# Altium project PCB_XEM-S91.PRJPCB (part 1 of 2)
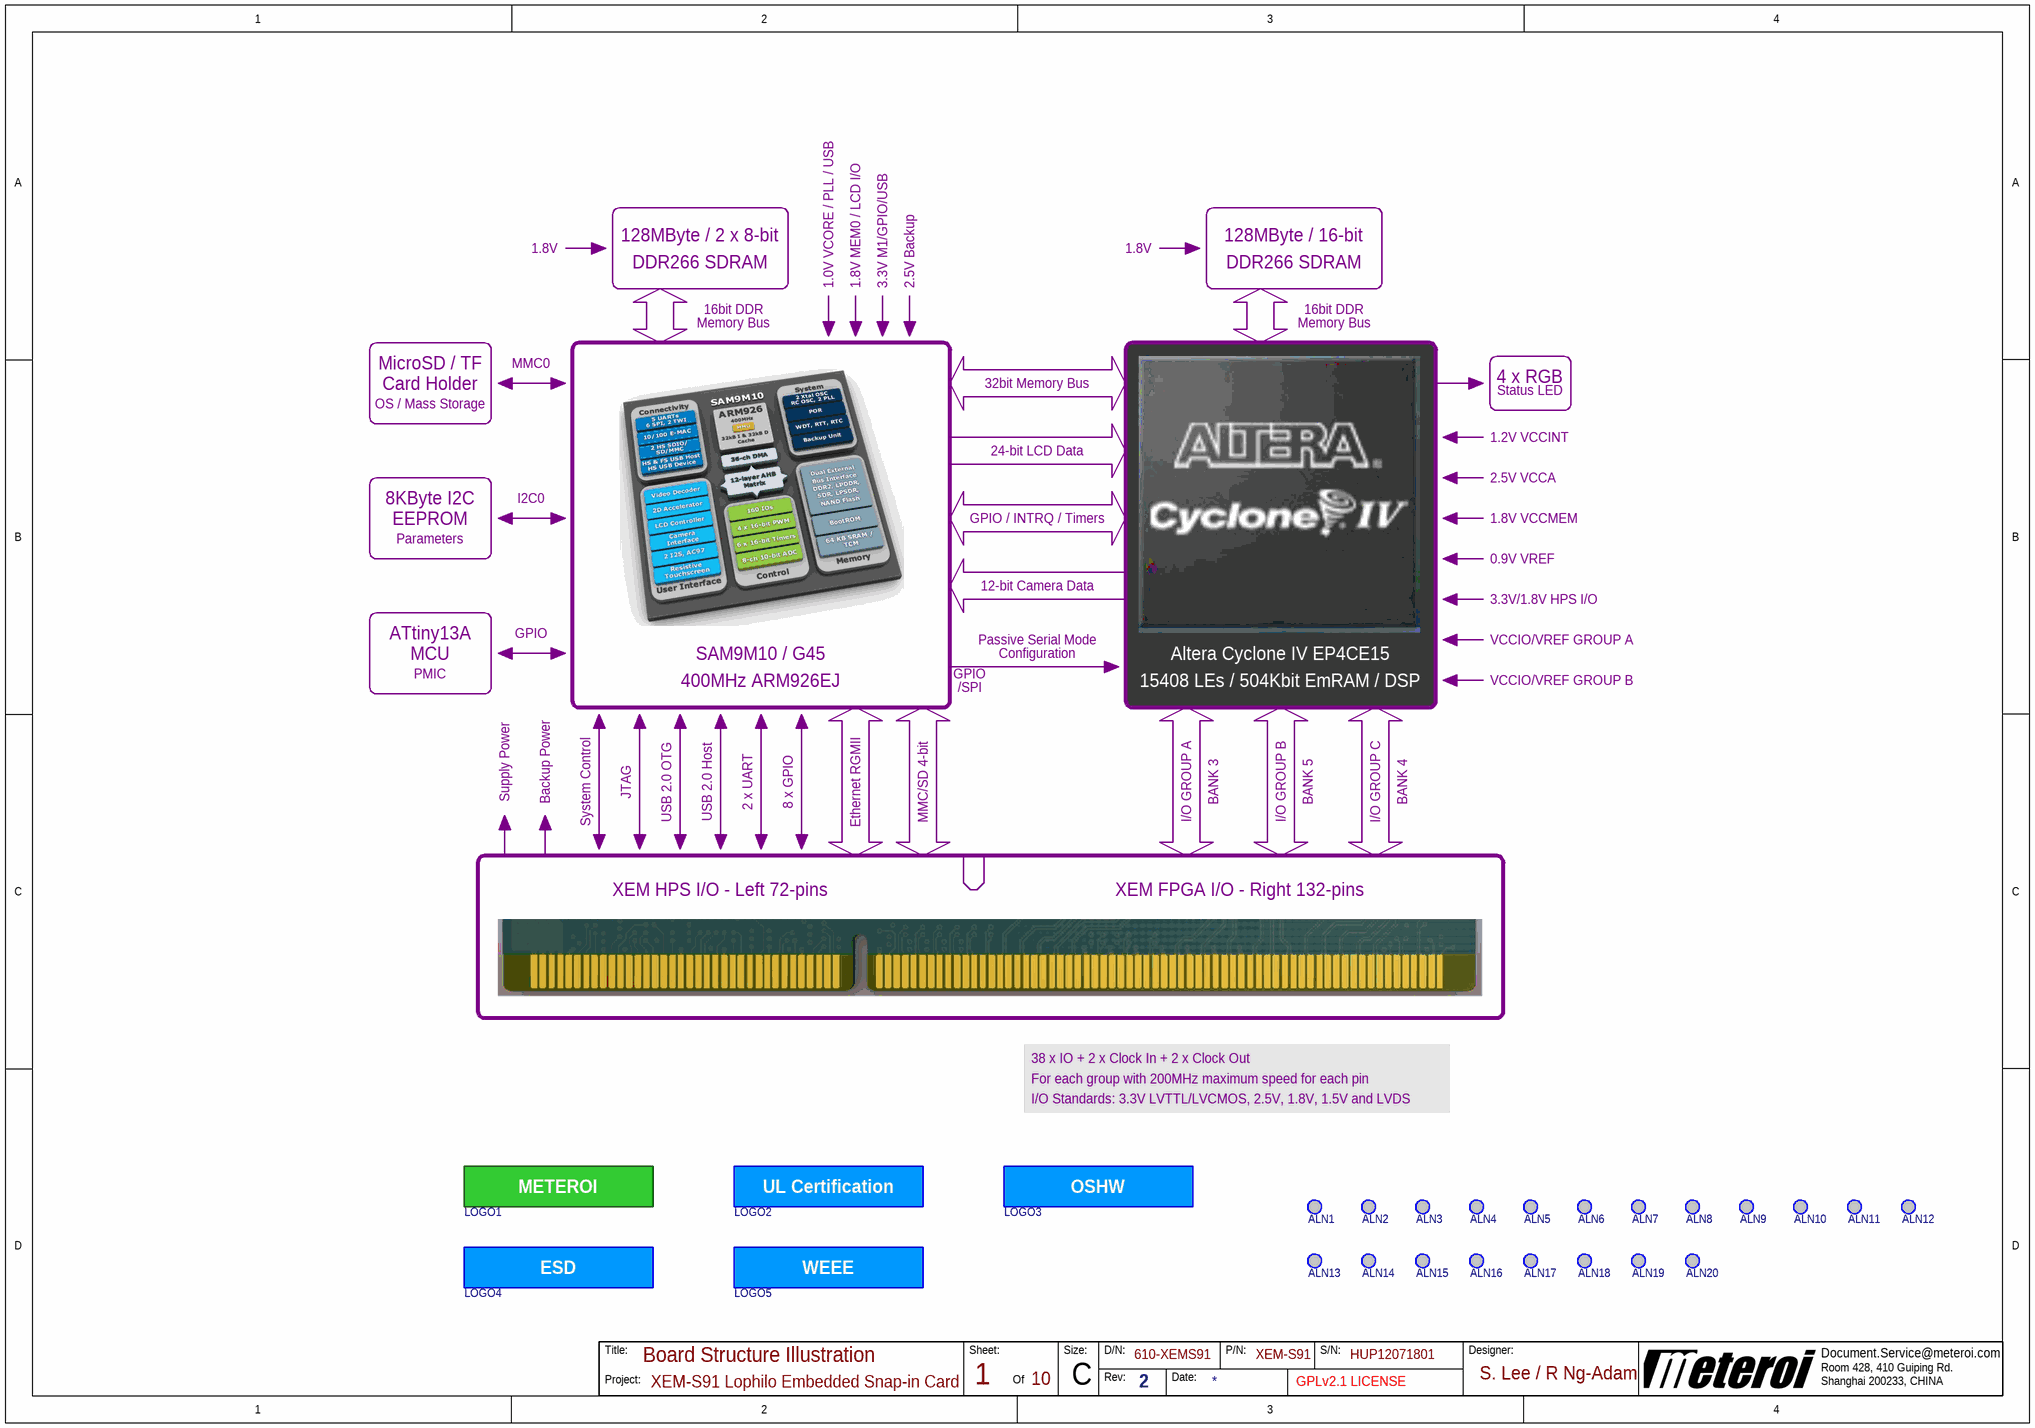
[diagram p0: 01_Structure.SchDoc]
ClassifiedLevel: GPLv2.1 LICENSE; Designer: S. Lee / R Ng-Adam; DocumentSerialNumber: 610-XEMS91; Email: Document.Service@meteroi.com; PartNumber: XEM-S91; PrjRevision: 2; SerialNumber: HUP12071801; SheetTotalNumber: 10; TopProjectName: XEM-S91 Lophilo Embedded Snap-in Card
10 sheets, 309 parts. Net scope: global (net labels, ports and power ports of the same name join across sheets).
Board file: PCB_XEM-S91.PcbDoc
Sheets:
  01_Structure.SchDoc
  02_XEM.SchDoc
  03_ARM_A.SchDoc
  04_ARM_B.SchDoc
  05_FPGA_A.SchDoc
  06_FPGA_B.SchDoc
  07_FPGA_C.SchDoc
  08_FPGA_D.SchDoc
  09_FPGA_E.SchDoc
  10_POWER.SchDoc

## Sheet 01_Structure.SchDoc: Board Structure Illustration
size 381 x 266 mm; Organization: Meteroi; Address1: Room 428, 410 Guiping Rd.; Address2: Shanghai 200233, CHINA; SheetNumber: 1; SheetTotal: 10; PageSetup: Record=PageOptions|CenterHorizontal=True|CenterVertical=True|PrintScale=0.75|XCorrection=1.00|YCorrection=1.00|PrintKind=2|BorderSize=5000000|LeftOffset=0|BottomOffset=0|Orientation=2|PaperLength=1000|PaperWidth=1000|Scale=100|PaperSource=276|PrintQuality=-3|MediaType=1|DitherType=10|PaperKind=A4|PrintScaleMode=1

### Parts
ALN1  Assembly Optical Align  [ALIGN_2]  (value not drawn)
ALN2  Assembly Optical Align  [ALIGN_2]  (value not drawn)
ALN3  Assembly Optical Align  [ALIGN_2]  (value not drawn)
ALN4  Assembly Optical Align  [ALIGN_2]  (value not drawn)
ALN5  Assembly Optical Align  [ALIGN_2]  (value not drawn)
ALN6  Assembly Optical Align  [ALIGN_2]  (value not drawn)
ALN7  Assembly Optical Align  [ALIGN_2]  (value not drawn)
ALN8  Assembly Optical Align  [ALIGN_2]  (value not drawn)
ALN9  Assembly Optical Align  [ALIGN_2]  (value not drawn)
ALN10  Assembly Optical Align  [ALIGN_2]  (value not drawn)
ALN11  Assembly Optical Align  [ALIGN_2]  (value not drawn)
ALN12  Assembly Optical Align  [ALIGN_2]  (value not drawn)
ALN13  Assembly Optical Align  [ALIGN_2]  (value not drawn)
ALN14  Assembly Optical Align  [ALIGN_2]  (value not drawn)
ALN15  Assembly Optical Align  [ALIGN_2]  (value not drawn)
ALN16  Assembly Optical Align  [ALIGN_2]  (value not drawn)
ALN17  Assembly Optical Align  [ALIGN_2]  (value not drawn)
ALN18  Assembly Optical Align  [ALIGN_2]  (value not drawn)
ALN19  Assembly Optical Align  [ALIGN_2]  (value not drawn)
ALN20  Assembly Optical Align  [ALIGN_2]  (value not drawn)
LOGO1  LOGO  [LOGO_METEROI_ST_12X3]  (value not drawn)
LOGO2  UL Certification  [REGULATION_PCB_UL]  (value not drawn)
LOGO3  OSHW  [LOGO_OSHW_1]  (value not drawn)
LOGO4  ESD  [REGULATION_ESD]  (value not drawn)
LOGO5  WEEE  [REGULATION_WEEE]  (value not drawn)

### Notes on the sheet
- 128MByte / 2 x 8-bit
- 128MByte / 16-bit
- 1.8V
- DDR266 SDRAM
- 1.0V VCORE / PLL / USB
- 1.8V MEM0 / LCD I/O
- 3.3V M1/GPIO/USB
- 2.5V Backup
- MicroSD / TF
- MMC0
- 16bit DDR
- Memory Bus
- 4 x RGB
- Card Holder
- OS / Mass Storage
- 32bit Memory Bus
- 1.2V VCCINT
- Status LED
- 8KByte I2C
- I2C0
- 24-bit LCD Data
- 2.5V VCCA
- EEPROM
- Parameters
- GPIO / INTRQ / Timers
- 1.8V VCCMEM
- 0.9V VREF
- ATtiny13A
- GPIO
- 12-bit Camera Data
- Passive Serial Mode
- 3.3V/1.8V HPS I/O
- VCCIO/VREF GROUP A
- MCU
- PMIC
- SAM9M10 / G45
- 400MHz ARM926EJ
- /SPI
- Configuration
- Altera Cyclone IV EP4CE15
- 15408 LEs / 504Kbit EmRAM / DSP
- VCCIO/VREF GROUP B
- Supply Power
- Backup Power
- System Control
- JTAG
- USB 2.0 OTG
- USB 2.0 Host
- 2 x UART
- 8 x GPIO
- Ethernet RGMII
- MMC/SD 4-bit
- I/O GROUP A
- BANK 3
- I/O GROUP B
- BANK 5
- I/O GROUP C
- BANK 4
- XEM HPS I/O - Left 72-pins
- XEM FPGA I/O - Right 132-pins
- 38 x IO + 2 x Clock In + 2 x Clock Out
- For each group with 200MHz maximum speed for each pin
- I/O Standards: 3.3V LVTTL/LVCMOS, 2.5V, 1.8V, 1.5V and LVDS
- Title:
- Project:
- Sheet:
- Of
- Size:
- D/N:
- Rev:
- Date:
- P/N:
- S/N:
- Designer:
- C
- (in symbol LOGO_METEROI) METEROI

### Library data of the parts
ALN1-ALN20 = ALIGN: Vendor: 0; Designer: shyul; PCBMarker: Aligner; Value: Assembly Optical Align; Version: 1.0; VersionDate: 05-21-2011; SerialNumber: 0; PartNumber: 0; Publisher: Cowin
LOGO1 = LOGO_METEROI: Meteroi Logo; Vendor: 0; Designer: shyul; Value: LOGO; Version: 1.0; VersionDate: 05-15-2011; SerialNumber: 0; PartNumber: 0; Publisher: Cowin; PCBMarker: LOGO
LOGO2 = REGULATION_PCB_UL: PCB UL Certification; Vendor: 0; Designer: shyul; Value: UL Certification; Version: 1.0; VersionDate: 05-15-2011; SerialNumber: 0; PartNumber: 0; Publisher: Cowin; PCBMarker: UL Certification
LOGO3 = REGULATION_OSHW: OSHW Logo; Vendor: 0; Designer: shyul; Value: OSHW; Version: 1.0; VersionDate: 06-02-2012; SerialNumber: 0; PartNumber: 0; Publisher: Cowin; PCBMarker: OSHW
LOGO4 = REGULATION_ESD: ESD Logo; Vendor: 0; Designer: shyul; Value: ESD; Version: 1.0; VersionDate: 05-15-2011; SerialNumber: 0; PartNumber: 0; Publisher: Cowin; PCBMarker: ESD
LOGO5 = REGULATION_WEEE: WEEE Logo; Vendor: 0; Designer: shyul; Value: WEEE; Version: 1.0; VersionDate: 05-15-2011; SerialNumber: 0; PartNumber: 0; Publisher: Cowin; PCBMarker: WEEE

## Sheet 02_XEM.SchDoc: XEM Card Edge Connector
size 381 x 266 mm; Organization: Meteroi; Address1: Room 428, 410 Guiping Rd.; Address2: Shanghai 200233, CHINA; SheetNumber: 2; SheetTotal: 10; PageSetup: Record=PageOptions|CenterHorizontal=True|CenterVertical=True|PrintScale=0.75|XCorrection=1.00|YCorrection=1.00|PrintKind=2|BorderSize=5000000|LeftOffset=0|BottomOffset=0|Orientation=2|PaperLength=1000|PaperWidth=1000|Scale=100|PaperSource=276|PrintQuality=-3|MediaType=1|DitherType=10|PaperKind=A4|PrintScaleMode=1
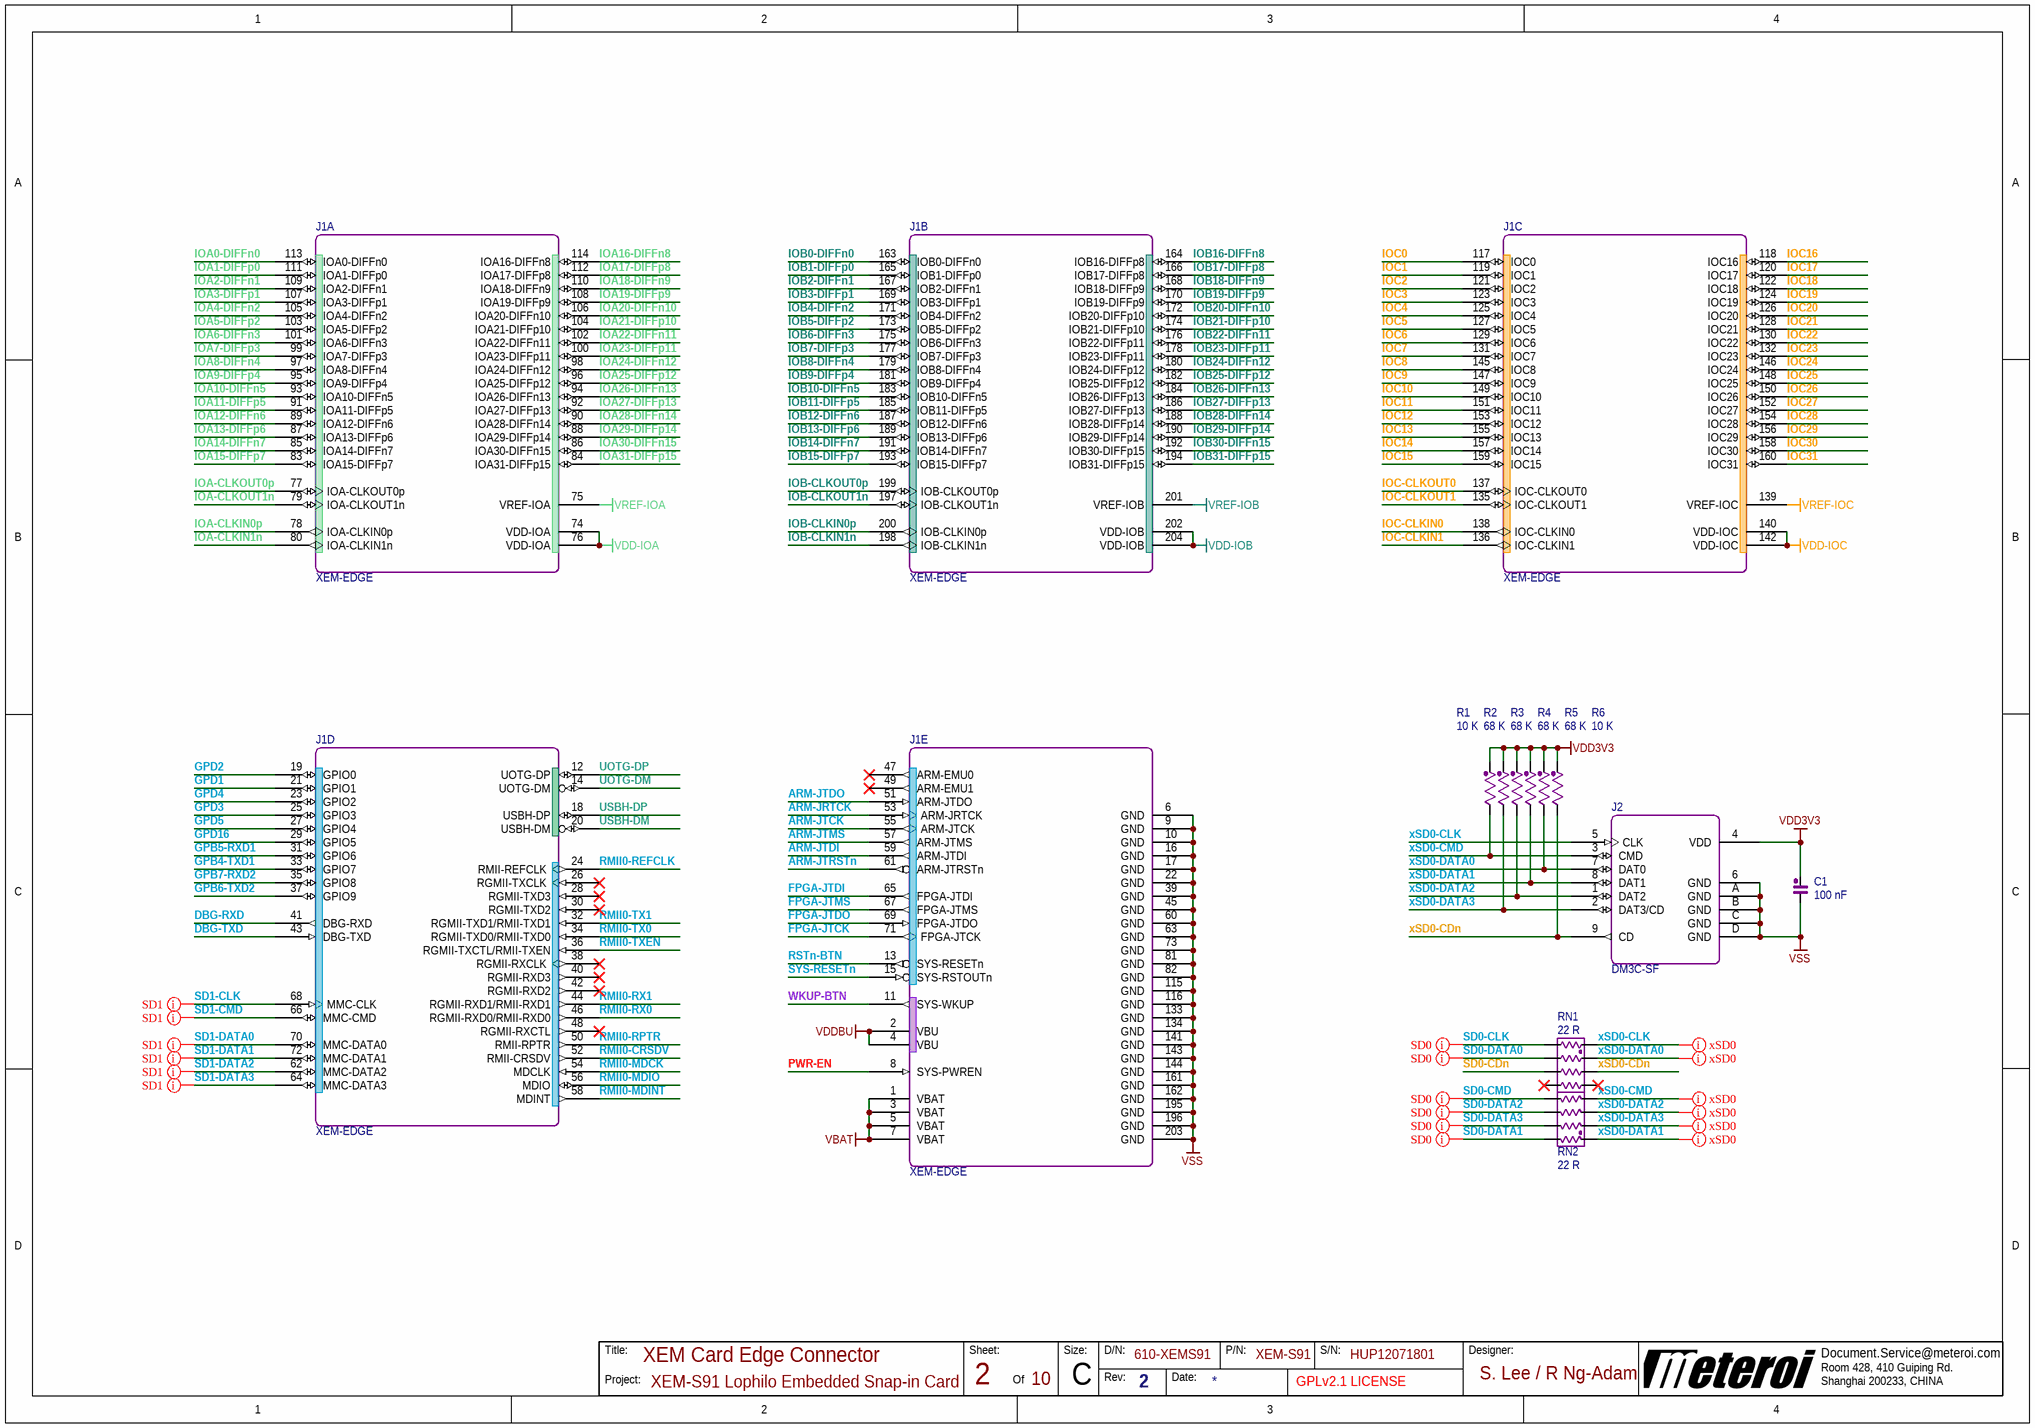
[diagram p1: 02_XEM.SchDoc]

### Parts
C1  100 nF  [0402A1]
J1  XEM-EDGE  [XEM-1C-204]  (parts A,B,C,D,E of 5)
J2  DM3C-SF  [DM3C-SF]
R1  10 K  [0402A2]
R2  68 K  [0402A2]
R3  68 K  [0402A2]
R4  68 K  [0402A2]
R5  68 K  [0402A2]
R6  10 K  [0402A2]
RN1  22 R  [0402PR4]
RN2  22 R  [0402PR4]

### Nets
VBAT: J1.1(VBAT) J1.3(VBAT) J1.5(VBAT) J1.7(VBAT)
VDD3V3: C1.2 J2.4(VDD) R1.2 R2.2 R3.2 R4.2 R5.2 R6.2
VDD-IOA: J1.74(VDD-IOA) J1.76(VDD-IOA)
VDD-IOB: J1.202(VDD-IOB) J1.204(VDD-IOB)
VDD-IOC: J1.140(VDD-IOC) J1.142(VDD-IOC)
VDDBU: J1.2(VBU) J1.4(VBU)
VREF-IOA: J1.75(VREF-IOA)
VREF-IOB: J1.201(VREF-IOB)
VREF-IOC: J1.139(VREF-IOC)
VSS: C1.1 J1.6(GND) J1.9(GND) J1.10(GND) J1.16(GND) J1.17(GND) J1.22(GND) J1.39(GND) J1.45(GND) J1.60(GND) J1.63(GND) J1.73(GND) J1.81(GND) J1.82(GND) J1.115(GND) J1.116(GND) J1.133(GND) J1.134(GND) J1.141(GND) J1.143(GND) J1.144(GND) J1.161(GND) J1.162(GND) J1.195(GND) J1.196(GND) J1.203(GND) J2.6(GND) J2.A(GND) J2.B(GND) J2.C(GND) J2.D(GND)
ARM-JRTCK: J1.53(ARM-JRTCK)
ARM-JTCK: J1.55(ARM-JTCK)
ARM-JTDI: J1.59(ARM-JTDI)
ARM-JTDO: J1.51(ARM-JTDO)
ARM-JTMS: J1.57(ARM-JTMS)
ARM-JTRSTn: J1.61(ARM-JTRSTn)
DBG-RXD: J1.41(DBG-RXD)
DBG-TXD: J1.43(DBG-TXD)
FPGA-JTCK: J1.71(FPGA-JTCK)
FPGA-JTDI: J1.65(FPGA-JTDI)
FPGA-JTDO: J1.69(FPGA-JTDO)
FPGA-JTMS: J1.67(FPGA-JTMS)
GPB4-TXD1: J1.33(GPIO7)
GPB5-RXD1: J1.31(GPIO6)
GPB6-TXD2: J1.37(GPIO9)
GPB7-RXD2: J1.35(GPIO8)
GPD1: J1.21(GPIO1)
GPD2: J1.19(GPIO0)
GPD3: J1.25(GPIO3)
GPD4: J1.23(GPIO2)
GPD5: J1.27(GPIO4)
GPD16: J1.29(GPIO5)
IOA0-DIFFn0: J1.113(IOA0-DIFFn0)
IOA1-DIFFp0: J1.111(IOA1-DIFFp0)
IOA2-DIFFn1: J1.109(IOA2-DIFFn1)
IOA3-DIFFp1: J1.107(IOA3-DIFFp1)
IOA4-DIFFn2: J1.105(IOA4-DIFFn2)
IOA5-DIFFp2: J1.103(IOA5-DIFFp2)
IOA6-DIFFn3: J1.101(IOA6-DIFFn3)
IOA7-DIFFp3: J1.99(IOA7-DIFFp3)
IOA8-DIFFn4: J1.97(IOA8-DIFFn4)
IOA9-DIFFp4: J1.95(IOA9-DIFFp4)
IOA10-DIFFn5: J1.93(IOA10-DIFFn5)
IOA11-DIFFp5: J1.91(IOA11-DIFFp5)
IOA12-DIFFn6: J1.89(IOA12-DIFFn6)
IOA13-DIFFp6: J1.87(IOA13-DIFFp6)
IOA14-DIFFn7: J1.85(IOA14-DIFFn7)
IOA15-DIFFp7: J1.83(IOA15-DIFFp7)
IOA16-DIFFn8: J1.114(IOA16-DIFFn8)
IOA17-DIFFp8: J1.112(IOA17-DIFFp8)
IOA18-DIFFn9: J1.110(IOA18-DIFFn9)
IOA19-DIFFp9: J1.108(IOA19-DIFFp9)
IOA20-DIFFn10: J1.106(IOA20-DIFFn10)
IOA21-DIFFp10: J1.104(IOA21-DIFFp10)
IOA22-DIFFn11: J1.102(IOA22-DIFFn11)
IOA23-DIFFp11: J1.100(IOA23-DIFFp11)
IOA24-DIFFn12: J1.98(IOA24-DIFFn12)
IOA25-DIFFp12: J1.96(IOA25-DIFFp12)
IOA26-DIFFn13: J1.94(IOA26-DIFFn13)
IOA27-DIFFp13: J1.92(IOA27-DIFFp13)
IOA28-DIFFn14: J1.90(IOA28-DIFFn14)
IOA29-DIFFp14: J1.88(IOA29-DIFFp14)
IOA30-DIFFn15: J1.86(IOA30-DIFFn15)
IOA31-DIFFp15: J1.84(IOA31-DIFFp15)
IOA-CLKIN0p: J1.78(IOA-CLKIN0p)
IOA-CLKIN1n: J1.80(IOA-CLKIN1n)
IOA-CLKOUT0p: J1.77(IOA-CLKOUT0p)
IOA-CLKOUT1n: J1.79(IOA-CLKOUT1n)
IOB0-DIFFn0: J1.163(IOB0-DIFFn0)
IOB1-DIFFp0: J1.165(IOB1-DIFFp0)
IOB2-DIFFn1: J1.167(IOB2-DIFFn1)
IOB3-DIFFp1: J1.169(IOB3-DIFFp1)
IOB4-DIFFn2: J1.171(IOB4-DIFFn2)
IOB5-DIFFp2: J1.173(IOB5-DIFFp2)
IOB6-DIFFn3: J1.175(IOB6-DIFFn3)
IOB7-DIFFp3: J1.177(IOB7-DIFFp3)
IOB8-DIFFn4: J1.179(IOB8-DIFFn4)
IOB9-DIFFp4: J1.181(IOB9-DIFFp4)
IOB10-DIFFn5: J1.183(IOB10-DIFFn5)
IOB11-DIFFp5: J1.185(IOB11-DIFFp5)
IOB12-DIFFn6: J1.187(IOB12-DIFFn6)
IOB13-DIFFp6: J1.189(IOB13-DIFFp6)
IOB14-DIFFn7: J1.191(IOB14-DIFFn7)
IOB15-DIFFp7: J1.193(IOB15-DIFFp7)
IOB16-DIFFn8: J1.164(IOB16-DIFFp8)
IOB17-DIFFp8: J1.166(IOB17-DIFFp8)
IOB18-DIFFn9: J1.168(IOB18-DIFFp9)
IOB19-DIFFp9: J1.170(IOB19-DIFFp9)
IOB20-DIFFn10: J1.172(IOB20-DIFFp10)
IOB21-DIFFp10: J1.174(IOB21-DIFFp10)
IOB22-DIFFn11: J1.176(IOB22-DIFFp11)
IOB23-DIFFp11: J1.178(IOB23-DIFFp11)
IOB24-DIFFn12: J1.180(IOB24-DIFFp12)
IOB25-DIFFp12: J1.182(IOB25-DIFFp12)
IOB26-DIFFn13: J1.184(IOB26-DIFFp13)
IOB27-DIFFp13: J1.186(IOB27-DIFFp13)
IOB28-DIFFn14: J1.188(IOB28-DIFFp14)
IOB29-DIFFp14: J1.190(IOB29-DIFFp14)
IOB30-DIFFn15: J1.192(IOB30-DIFFp15)
IOB31-DIFFp15: J1.194(IOB31-DIFFp15)
IOB-CLKIN0p: J1.200(IOB-CLKIN0p)
IOB-CLKIN1n: J1.198(IOB-CLKIN1n)
IOB-CLKOUT0p: J1.199(IOB-CLKOUT0p)
IOB-CLKOUT1n: J1.197(IOB-CLKOUT1n)
IOC0: J1.117(IOC0)
IOC1: J1.119(IOC1)
IOC2: J1.121(IOC2)
IOC3: J1.123(IOC3)
IOC4: J1.125(IOC4)
IOC5: J1.127(IOC5)
IOC6: J1.129(IOC6)
IOC7: J1.131(IOC7)
IOC8: J1.145(IOC8)
IOC9: J1.147(IOC9)
IOC10: J1.149(IOC10)
IOC11: J1.151(IOC11)
IOC12: J1.153(IOC12)
IOC13: J1.155(IOC13)
IOC14: J1.157(IOC14)
IOC15: J1.159(IOC15)
IOC16: J1.118(IOC16)
IOC17: J1.120(IOC17)
IOC18: J1.122(IOC18)
IOC19: J1.124(IOC19)
IOC20: J1.126(IOC20)
IOC21: J1.128(IOC21)
IOC22: J1.130(IOC22)
IOC23: J1.132(IOC23)
IOC24: J1.146(IOC24)
IOC25: J1.148(IOC25)
IOC26: J1.150(IOC26)
IOC27: J1.152(IOC27)
IOC28: J1.154(IOC28)
IOC29: J1.156(IOC29)
IOC30: J1.158(IOC30)
IOC31: J1.160(IOC31)
IOC-CLKIN0: J1.138(IOC-CLKIN0)
IOC-CLKIN1: J1.136(IOC-CLKIN1)
IOC-CLKOUT0: J1.137(IOC-CLKOUT0)
IOC-CLKOUT1: J1.135(IOC-CLKOUT1)
PWR-EN: J1.8(SYS-PWREN)
RMII0-CRSDV: J1.52(RMII-CRSDV)
RMII0-MDCK: J1.54(MDCLK)
RMII0-MDINT: J1.58(MDINT)
RMII0-MDIO: J1.56(MDIO)
RMII0-REFCLK: J1.24(RMII-REFCLK)
RMII0-RPTR: J1.50(RMII-RPTR)
RMII0-RX0: J1.46(RGMII-RXD0/RMII-RXD0)
RMII0-RX1: J1.44(RGMII-RXD1/RMII-RXD1)
RMII0-TX0: J1.34(RGMII-TXD0/RMII-TXD0)
RMII0-TX1: J1.32(RGMII-TXD1/RMII-TXD1)
RMII0-TXEN: J1.36(RGMII-TXCTL/RMII-TXEN)
RSTn-BTN: J1.13(SYS-RESETn)
SD0-CDn: RN1.6
SD0-CLK: RN1.2
SD0-CMD: RN2.8
SD0-DATA0: RN1.4
SD0-DATA1: RN2.2
SD0-DATA2: RN2.6
SD0-DATA3: RN2.4
SD1-CLK: J1.68(MMC-CLK)
SD1-CMD: J1.66(MMC-CMD)
SD1-DATA0: J1.70(MMC-DATA0)
SD1-DATA1: J1.72(MMC-DATA1)
SD1-DATA2: J1.62(MMC-DATA2)
SD1-DATA3: J1.64(MMC-DATA3)
SYS-RESETn: J1.15(SYS-RSTOUTn)
UOTG-DM: J1.14(UOTG-DM)
UOTG-DP: J1.12(UOTG-DP)
USBH-DM: J1.20(USBH-DM)
USBH-DP: J1.18(USBH-DP)
WKUP-BTN: J1.11(SYS-WKUP)
xSD0-CDn: J2.9(CD) R6.1 RN1.5
xSD0-CLK: J2.5(CLK) RN1.1
xSD0-CMD: J2.3(CMD) R1.1 RN2.7
xSD0-DATA0: J2.7(DAT0) R5.1 RN1.3
xSD0-DATA1: J2.8(DAT1) R4.1 RN2.1
xSD0-DATA2: J2.1(DAT2) R3.1 RN2.5
xSD0-DATA3: J2.2(DAT3/CD) R2.1 RN2.3

Not connected (* = marked no-connect by the designer): J1 26(RGMII-TXCLK)* 28(RGMII-TXD3)* 30(RGMII-TXD2)* 38(RGMII-RXCLK)* 40(RGMII-RXD3)* 42(RGMII-RXD2)* 47(ARM-EMU0)* 48(RGMII-RXCTL)* 49(ARM-EMU1)*; RN1 7* 8*

### Layout directives
net class xSD0: xSD0-CLK, xSD0-CMD, xSD0-DATA0, xSD0-DATA1, xSD0-DATA2, xSD0-DATA3
net class SD0: SD0-CLK, SD0-CMD, SD0-DATA0, SD0-DATA1, SD0-DATA2, SD0-DATA3
net class SD1: SD1-CLK, SD1-CMD, SD1-DATA0, SD1-DATA1, SD1-DATA2, SD1-DATA3

### Notes on the sheet
- Title:
- Project:
- Sheet:
- Of
- Size:
- D/N:
- Rev:
- Date:
- P/N:
- S/N:
- Designer:
- C

### Library data of the parts
C1 = CAP: Normal Capacitor; PartNumber: 0; Vendor: muRata; Designer: shyul; PinCountSMD: 2; Value: 100 nF; SerialNumber: 0; Publisher: Cowin; PCBMarker: Capacitor; Version: 1.0; VersionDate: 04-27-2011; PinCountHole: 0
J1 = XEM-EDGE: XEM Edge Connector 204-pins; Vendor: Cowin; PinCountSMD: 0; Designer: shyul; Value: XEM-EDGE; PartNumber: XEM-EDGE; Version: 1.0; VersionDate: 03-09-2012; PinCountHole: 0; SerialNumber: 0; Publisher: Cowin; PCBMarker: XEM
J2 = DM3C-SF: Simple Switch 600mA Adjustable; Vendor: Hirose; PinCountSMD: 13; PinCountHole: 0; Designer: shyul; PCBMarker: SDMicro; Value: DM3C-SF; PartNumber: DM3C-SF; Version: 1.0; VersionDate: 02-23-2012; SerialNumber: 0; Publisher: Cowin
R1-R6 = RES: Normal Resistor; PartNumber: 0; Vendor: KOA; Designer: shyul; PinCountSMD: 2; SerialNumber: 0; Version: 1.0; VersionDate: 04-27-2011; PCBMarker: Resistor; Publisher: Cowin; PinCountHole: 0
  R1 R6: Value: 10 K
  R2-R5: Value: 68 K
RN1 RN2 = RES_N4: Resistor Array x4; PartNumber: YC124-JR-0722RL; SerialNumber: 0; Vendor: YAGEO; Designer: shyul; PinCountSMD: 8; Value: 22 R; Version: 1.0; VersionDate: 04-27-2011; Publisher: Cowin; PCBMarker: Resistor Array; PinCountHole: 0

## Sheet 03_ARM_A.SchDoc: ARM Part A: EMIF / RAM
size 381 x 266 mm; Organization: Meteroi; Address1: Room 428, 410 Guiping Rd.; Address2: Shanghai 200233, CHINA; SheetNumber: 3; SheetTotal: 11; PageSetup: Record=PageOptions|CenterHorizontal=True|CenterVertical=True|PrintScale=0.75|XCorrection=1.00|YCorrection=1.00|PrintKind=2|BorderSize=5000000|LeftOffset=0|BottomOffset=0|Orientation=2|PaperLength=1000|PaperWidth=1000|Scale=100|PaperSource=276|PrintQuality=-3|MediaType=1|DitherType=10|PaperKind=A4|PrintScaleMode=1
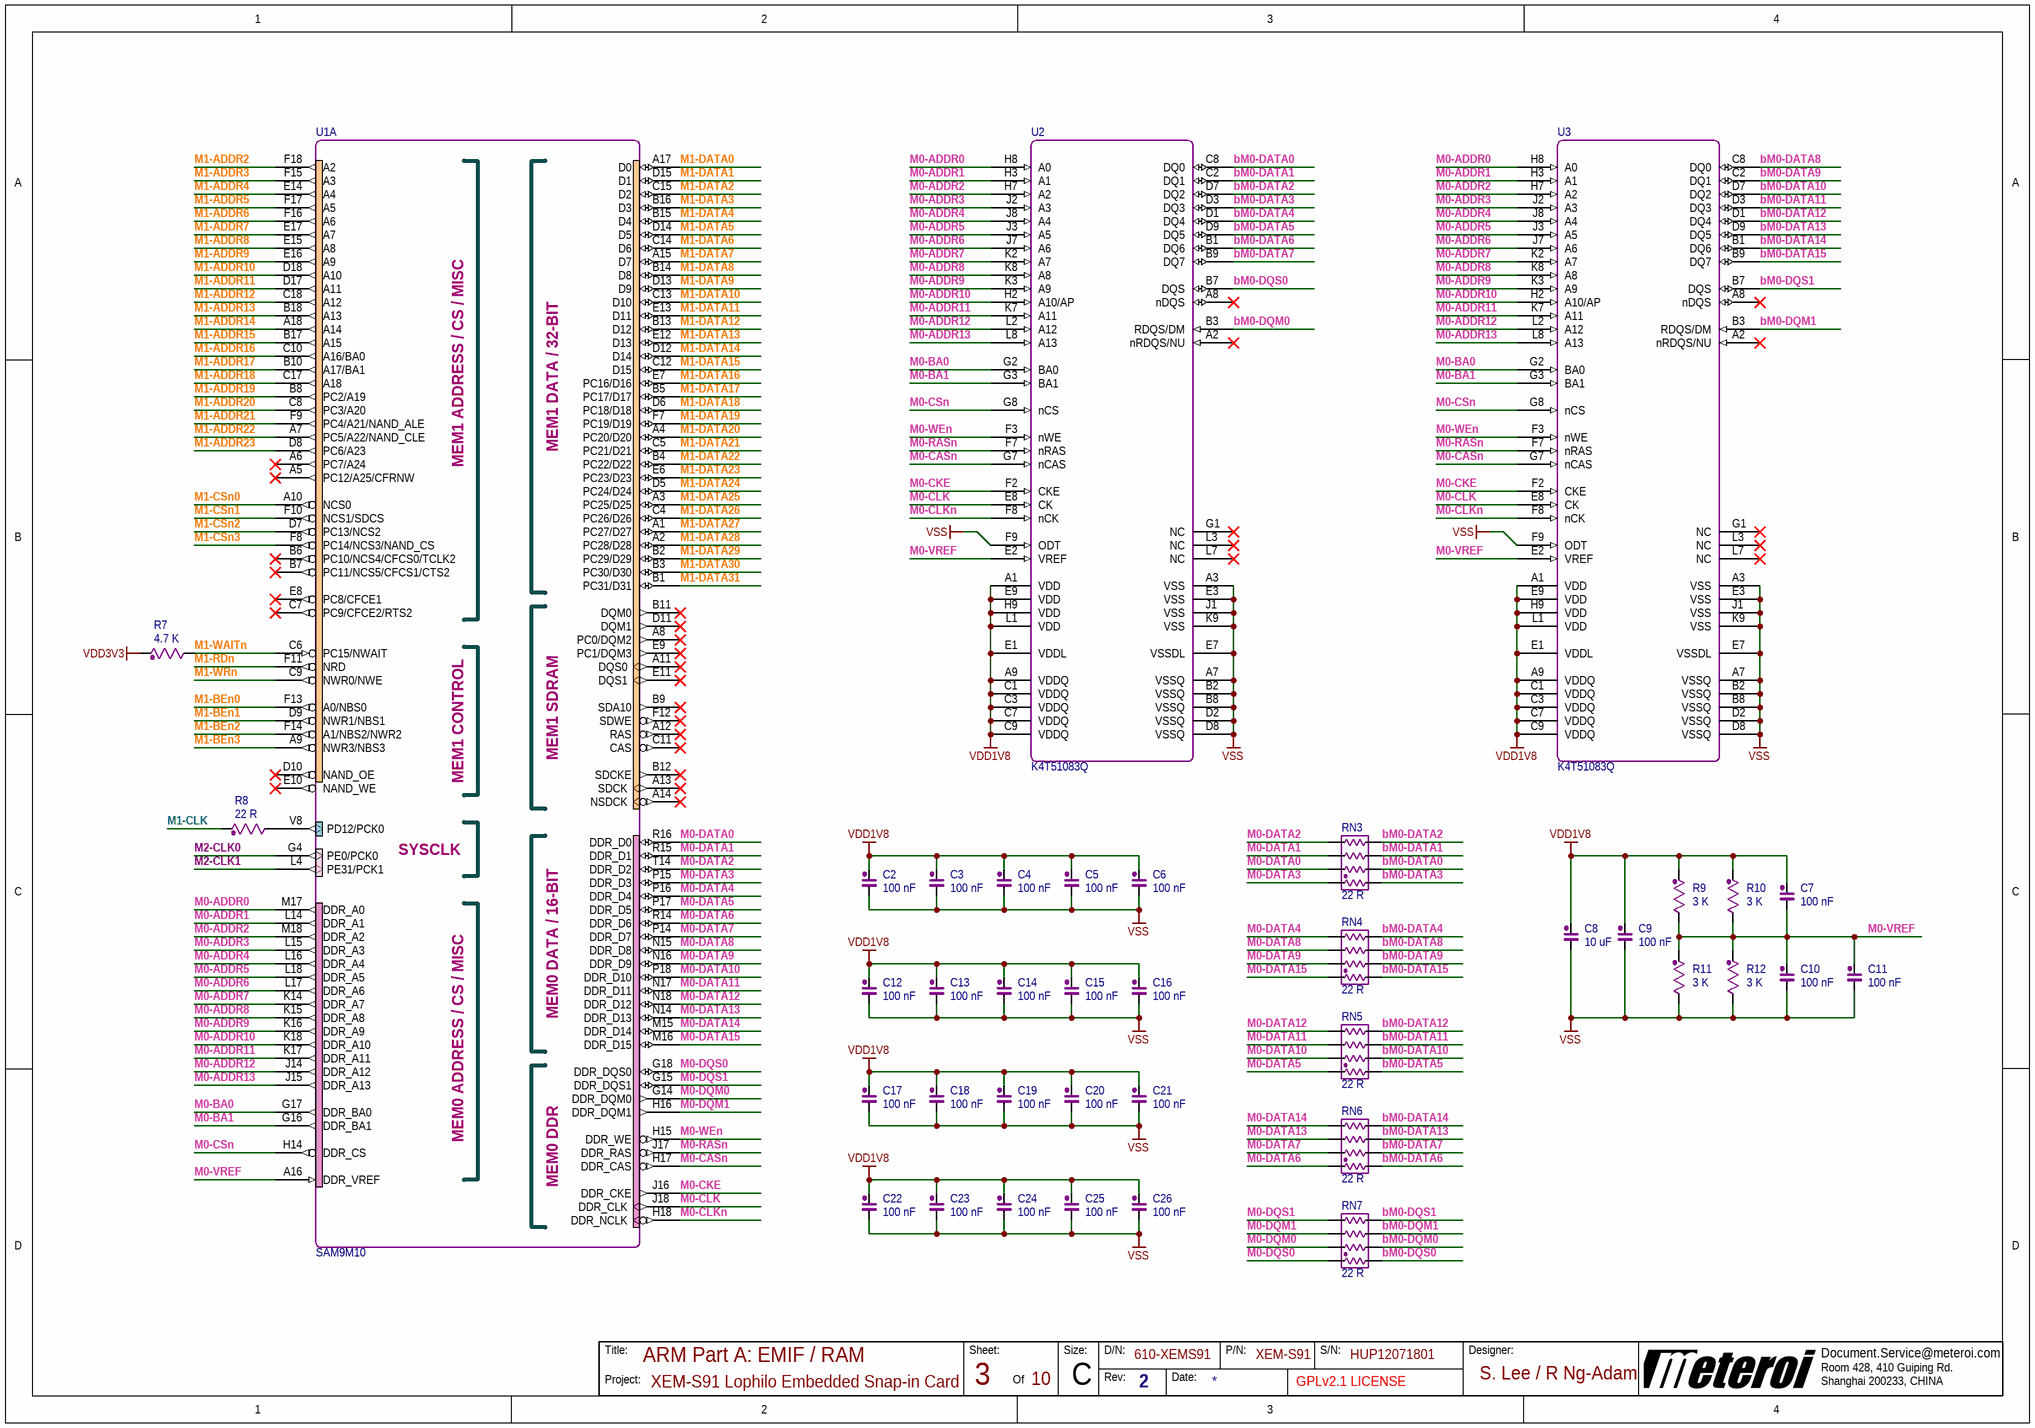
[diagram p2: 03_ARM_A.SchDoc]

### Parts
C2  100 nF  [0402A1]
C3  100 nF  [0402A1]
C4  100 nF  [0402A1]
C5  100 nF  [0402A1]
C6  100 nF  [0402A1]
C7  100 nF  [0402A1]
C8  10 uF  [0603A1]
C9  100 nF  [0402A1]
C10  100 nF  [0402A1]
C11  100 nF  [0402A1]
C12  100 nF  [0402A1]
C13  100 nF  [0402A1]
C14  100 nF  [0402A1]
C15  100 nF  [0402A1]
C16  100 nF  [0402A1]
C17  100 nF  [0402A1]
C18  100 nF  [0402A1]
C19  100 nF  [0402A1]
C20  100 nF  [0402A1]
C21  100 nF  [0402A1]
C22  100 nF  [0402A1]
C23  100 nF  [0402A1]
C24  100 nF  [0402A1]
C25  100 nF  [0402A1]
C26  100 nF  [0402A1]
R7  4.7 K  [0402A2]
R8  22 R  [0402A2]
R9  3 K  [0402A2]
R10  3 K  [0402A2]
R11  3 K  [0402A2]
R12  3 K  [0402A2]
RN3  22 R  [0402PR4]
RN4  22 R  [0402PR4]
RN5  22 R  [0402PR4]
RN6  22 R  [0402PR4]
RN7  22 R  [0402PR4]
U1  SAM9M10  [TFBGA-324]  (part A of 3)
U2  K4T51083Q  [FBGA-DDR-60]
U3  K4T51083Q  [FBGA-DDR-60]

### Nets
VDD1V8: C2.2 C3.2 C4.2 C5.2 C6.2 C7.2 C8.2 C9.2 C12.2 C13.2 C14.2 C15.2 C16.2 C17.2 C18.2 C19.2 C20.2 C21.2 C22.2 C23.2 C24.2 C25.2 C26.2 R9.2 R10.2 U2.A1(VDD) U2.A9(VDDQ) U2.C1(VDDQ) U2.C3(VDDQ) U2.C7(VDDQ) U2.C9(VDDQ) U2.E1(VDDL) U2.E9(VDD) U2.H9(VDD) U2.L1(VDD) U3.A1(VDD) U3.A9(VDDQ) U3.C1(VDDQ) U3.C3(VDDQ) U3.C7(VDDQ) U3.C9(VDDQ) U3.E1(VDDL) U3.E9(VDD) U3.H9(VDD) U3.L1(VDD)
VDD3V3: R7.2
VSS: C2.1 C3.1 C4.1 C5.1 C6.1 C8.1 C9.1 C10.1 C11.1 C12.1 C13.1 C14.1 C15.1 C16.1 C17.1 C18.1 C19.1 C20.1 C21.1 C22.1 C23.1 C24.1 C25.1 C26.1 R11.1 R12.1 U2.A3(VSS) U2.A7(VSSQ) U2.B2(VSSQ) U2.B8(VSSQ) U2.D2(VSSQ) U2.D8(VSSQ) U2.E3(VSS) U2.E7(VSSDL) U2.F9(ODT) U2.J1(VSS) U2.K9(VSS) U3.A3(VSS) U3.A7(VSSQ) U3.B2(VSSQ) U3.B8(VSSQ) U3.D2(VSSQ) U3.D8(VSSQ) U3.E3(VSS) U3.E7(VSSDL) U3.F9(ODT) U3.J1(VSS) U3.K9(VSS)
bM0-DATA0: RN3.4 U2.C8(DQ0)
bM0-DATA1: RN3.6 U2.C2(DQ1)
bM0-DATA2: RN3.8 U2.D7(DQ2)
bM0-DATA3: RN3.2 U2.D3(DQ3)
bM0-DATA4: RN4.8 U2.D1(DQ4)
bM0-DATA5: RN5.2 U2.D9(DQ5)
bM0-DATA6: RN6.2 U2.B1(DQ6)
bM0-DATA7: RN6.4 U2.B9(DQ7)
bM0-DATA8: RN4.6 U3.C8(DQ0)
bM0-DATA9: RN4.4 U3.C2(DQ1)
bM0-DATA10: RN5.4 U3.D7(DQ2)
bM0-DATA11: RN5.6 U3.D3(DQ3)
bM0-DATA12: RN5.8 U3.D1(DQ4)
bM0-DATA13: RN6.6 U3.D9(DQ5)
bM0-DATA14: RN6.8 U3.B1(DQ6)
bM0-DATA15: RN4.2 U3.B9(DQ7)
bM0-DQM0: RN7.4 U2.B3(RDQS/DM)
bM0-DQM1: RN7.6 U3.B3(RDQS/DM)
bM0-DQS0: RN7.2 U2.B7(DQS)
bM0-DQS1: RN7.8 U3.B7(DQS)
M0-ADDR0: U1.M17(DDR_A0) U2.H8(A0) U3.H8(A0)
M0-ADDR1: U1.L14(DDR_A1) U2.H3(A1) U3.H3(A1)
M0-ADDR2: U1.M18(DDR_A2) U2.H7(A2) U3.H7(A2)
M0-ADDR3: U1.L15(DDR_A3) U2.J2(A3) U3.J2(A3)
M0-ADDR4: U1.L16(DDR_A4) U2.J8(A4) U3.J8(A4)
M0-ADDR5: U1.L18(DDR_A5) U2.J3(A5) U3.J3(A5)
M0-ADDR6: U1.L17(DDR_A6) U2.J7(A6) U3.J7(A6)
M0-ADDR7: U1.K14(DDR_A7) U2.K2(A7) U3.K2(A7)
M0-ADDR8: U1.K15(DDR_A8) U2.K8(A8) U3.K8(A8)
M0-ADDR9: U1.K16(DDR_A9) U2.K3(A9) U3.K3(A9)
M0-ADDR10: U1.K18(DDR_A10) U2.H2(A10/AP) U3.H2(A10/AP)
M0-ADDR11: U1.K17(DDR_A11) U2.K7(A11) U3.K7(A11)
M0-ADDR12: U1.J14(DDR_A12) U2.L2(A12) U3.L2(A12)
M0-ADDR13: U1.J15(DDR_A13) U2.L8(A13) U3.L8(A13)
M0-BA0: U1.G17(DDR_BA0) U2.G2(BA0) U3.G2(BA0)
M0-BA1: U1.G16(DDR_BA1) U2.G3(BA1) U3.G3(BA1)
M0-CASn: U1.H17(DDR_CAS) U2.G7(nCAS) U3.G7(nCAS)
M0-CKE: U1.J16(DDR_CKE) U2.F2(CKE) U3.F2(CKE)
M0-CLK: U1.J18(DDR_CLK) U2.E8(CK) U3.E8(CK)
M0-CLKn: U1.H18(DDR_NCLK) U2.F8(nCK) U3.F8(nCK)
M0-CSn: U1.H14(DDR_CS) U2.G8(nCS) U3.G8(nCS)
M0-DATA0: RN3.3 U1.R16(DDR_D0)
M0-DATA1: RN3.5 U1.R15(DDR_D1)
M0-DATA2: RN3.7 U1.T14(DDR_D2)
M0-DATA3: RN3.1 U1.P15(DDR_D3)
M0-DATA4: RN4.7 U1.P16(DDR_D4)
M0-DATA5: RN5.1 U1.P17(DDR_D5)
M0-DATA6: RN6.1 U1.R14(DDR_D6)
M0-DATA7: RN6.3 U1.P14(DDR_D7)
M0-DATA8: RN4.5 U1.N15(DDR_D8)
M0-DATA9: RN4.3 U1.N16(DDR_D9)
M0-DATA10: RN5.3 U1.P18(DDR_D10)
M0-DATA11: RN5.5 U1.N17(DDR_D11)
M0-DATA12: RN5.7 U1.N18(DDR_D12)
M0-DATA13: RN6.5 U1.N14(DDR_D13)
M0-DATA14: RN6.7 U1.M15(DDR_D14)
M0-DATA15: RN4.1 U1.M16(DDR_D15)
M0-DQM0: RN7.3 U1.G14(DDR_DQM0)
M0-DQM1: RN7.5 U1.H16(DDR_DQM1)
M0-DQS0: RN7.1 U1.G18(DDR_DQS0)
M0-DQS1: RN7.7 U1.G15(DDR_DQS1)
M0-RASn: U1.J17(DDR_RAS) U2.F7(nRAS) U3.F7(nRAS)
M0-VREF: C7.1 C10.2 C11.2 R9.1 R10.1 R11.2 R12.2 U1.A16(DDR_VREF) U2.E2(VREF) U3.E2(VREF)
M0-WEn: U1.H15(DDR_WE) U2.F3(nWE) U3.F3(nWE)
M1-ADDR2: U1.F18(A2)
M1-ADDR3: U1.F15(A3)
M1-ADDR4: U1.E14(A4)
M1-ADDR5: U1.F17(A5)
M1-ADDR6: U1.F16(A6)
M1-ADDR7: U1.E17(A7)
M1-ADDR8: U1.E15(A8)
M1-ADDR9: U1.E16(A9)
M1-ADDR10: U1.D18(A10)
M1-ADDR11: U1.D17(A11)
M1-ADDR12: U1.C18(A12)
M1-ADDR13: U1.B18(A13)
M1-ADDR14: U1.A18(A14)
M1-ADDR15: U1.B17(A15)
M1-ADDR16: U1.C10(A16/BA0)
M1-ADDR17: U1.B10(A17/BA1)
M1-ADDR18: U1.C17(A18)
M1-ADDR19: U1.B8(PC2/A19)
M1-ADDR20: U1.C8(PC3/A20)
M1-ADDR21: U1.F9(PC4/A21/NAND_ALE)
M1-ADDR22: U1.A7(PC5/A22/NAND_CLE)
M1-ADDR23: U1.D8(PC6/A23)
M1-BEn0: U1.F13(A0/NBS0)
M1-BEn1: U1.D9(NWR1/NBS1)
M1-BEn2: U1.F14(A1/NBS2/NWR2)
M1-BEn3: U1.A9(NWR3/NBS3)
M1-CLK: R8.2
M1-CSn0: U1.A10(NCS0)
M1-CSn1: U1.F10(NCS1/SDCS)
M1-CSn2: U1.D7(PC13/NCS2)
M1-CSn3: U1.F8(PC14/NCS3/NAND_CS)
M1-DATA0: U1.A17(D0)
M1-DATA1: U1.D15(D1)
M1-DATA2: U1.C15(D2)
M1-DATA3: U1.B16(D3)
M1-DATA4: U1.B15(D4)
M1-DATA5: U1.D14(D5)
M1-DATA6: U1.C14(D6)
M1-DATA7: U1.A15(D7)
M1-DATA8: U1.B14(D8)
M1-DATA9: U1.D13(D9)
M1-DATA10: U1.C13(D10)
M1-DATA11: U1.E13(D11)
M1-DATA12: U1.B13(D12)
M1-DATA13: U1.E12(D13)
M1-DATA14: U1.D12(D14)
M1-DATA15: U1.C12(D15)
M1-DATA16: U1.E7(PC16/D16)
M1-DATA17: U1.B5(PC17/D17)
M1-DATA18: U1.D6(PC18/D18)
M1-DATA19: U1.F7(PC19/D19)
M1-DATA20: U1.A4(PC20/D20)
M1-DATA21: U1.C5(PC21/D21)
M1-DATA22: U1.B4(PC22/D22)
M1-DATA23: U1.E6(PC23/D23)
M1-DATA24: U1.D5(PC24/D24)
M1-DATA25: U1.A3(PC25/D25)
M1-DATA26: U1.C4(PC26/D26)
M1-DATA27: U1.A1(PC27/D27)
M1-DATA28: U1.A2(PC28/D28)
M1-DATA29: U1.B2(PC29/D29)
M1-DATA30: U1.B3(PC30/D30)
M1-DATA31: U1.B1(PC31/D31)
M1-RDn: U1.F11(NRD)
M1-WAITn: R7.1 U1.C6(PC15/NWAIT)
M1-WRn: U1.C9(NWR0/NWE)
M2-CLK0: U1.G4(PE0/PCK0)
M2-CLK1: U1.L4(PE31/PCK1)
NetR8_1: R8.1 U1.V8(PD12/PCK0)

Not connected (* = marked no-connect by the designer): U1 A5(PC12/A25/CFRNW)* A6(PC7/A24)* A8(PC0/DQM2)* A11(DQS0)* A12(RAS)* A13(SDCK)* A14(NSDCK)* B6(PC10/NCS4/CFCS0/TCLK2)* B7(PC11/NCS5/CFCS1/CTS2)* B9(SDA10)* B11(DQM0)* B12(SDCKE)* C7(PC9/CFCE2/RTS2)* C11(CAS)* D10(NAND_OE)* D11(DQM1)* E8(PC8/CFCE1)* E9(PC1/DQM3)* E10(NAND_WE)* E11(DQS1)* F12(SDWE)*; U2 A2(nRDQS/NU)* A8(nDQS)* G1(NC)* L3(NC)* L7(NC)*; U3 A2(nRDQS/NU)* A8(nDQS)* G1(NC)* L3(NC)* L7(NC)*

### Notes on the sheet
- Title:
- Project:
- Sheet:
- Of
- Size:
- D/N:
- Rev:
- Date:
- P/N:
- S/N:
- Designer:
- C
- (in symbol SAM9M10, part A) MEM1 ADDRESS / CS / MISC; MEM1 DATA / 32-BIT; MEM1 SDRAM; MEM1 CONTROL; SYSCLK; MEM0 DATA / 16-BIT; MEM0 ADDRESS / CS / MISC; MEM0 DDR

### Library data of the parts
C2-C7 C9-C26 = CAP: as C1 on sheet 02_XEM; Value: 100 nF; SerialNumber: 0; Publisher: Cowin; PCBMarker: Capacitor; Version: 1.0; VersionDate: 04-27-2011; PinCountHole: 0
C8 = CAP: Normal Capacitor; PartNumber: 0; Value: 100 nF; Vendor: muRata; Designer: shyul; PinCountSMD: 2; SerialNumber: 0; Publisher: Cowin; PCBMarker: Capacitor; Version: 1.0; VersionDate: 04-27-2011; PinCountHole: 0
R7-R12 = RES: as R1 on sheet 02_XEM; SerialNumber: 0; Version: 1.0; VersionDate: 04-27-2011; PCBMarker: Resistor; Publisher: Cowin; PinCountHole: 0
  R7: Value: 4.7 K
  R8: Value: 22 R
  R9-R12: Value: 3 K
RN3-RN7 = RES_N4: as RN1 on sheet 02_XEM; Value: 22 R; Version: 1.0; VersionDate: 04-27-2011; Publisher: Cowin; PCBMarker: Resistor Array; PinCountHole: 0
U1 = SAM9M10: SAM9M10 Embedded Processor; PartNumber: AT91SAM9M10-CU; PCBMarker: ARM9; SerialNumber: 0; Vendor: Atmel; Designer: shyul; Version: 1.0; VersionDate: 2-15-2012; Value: SAM9M10; Publisher: Cowin
U2 U3 = K4T51083Q: K4T51083Q 64M x8 DDR2 SDRAM; PartNumber: K4T51083QI-BCE7; SerialNumber: 0; Vendor: SUMSUNG; Designer: shyul; PCBMarker: DDR2; Version: 1.0; VersionDate: 2-16-2012; Value: K4T51083Q; Publisher: Cowin

## Sheet 04_ARM_B.SchDoc: ARM Part B: Peripherals / System
size 381 x 266 mm; Organization: Meteroi; Address1: Room 428, 410 Guiping Rd.; Address2: Shanghai 200233, CHINA; SheetNumber: 4; SheetTotal: 11; PageSetup: Record=PageOptions|CenterHorizontal=True|CenterVertical=True|PrintScale=0.75|XCorrection=1.00|YCorrection=1.00|PrintKind=2|BorderSize=5000000|LeftOffset=0|BottomOffset=0|Orientation=2|PaperLength=1000|PaperWidth=1000|Scale=100|PaperSource=276|PrintQuality=-3|MediaType=1|DitherType=10|PaperKind=A4|PrintScaleMode=1
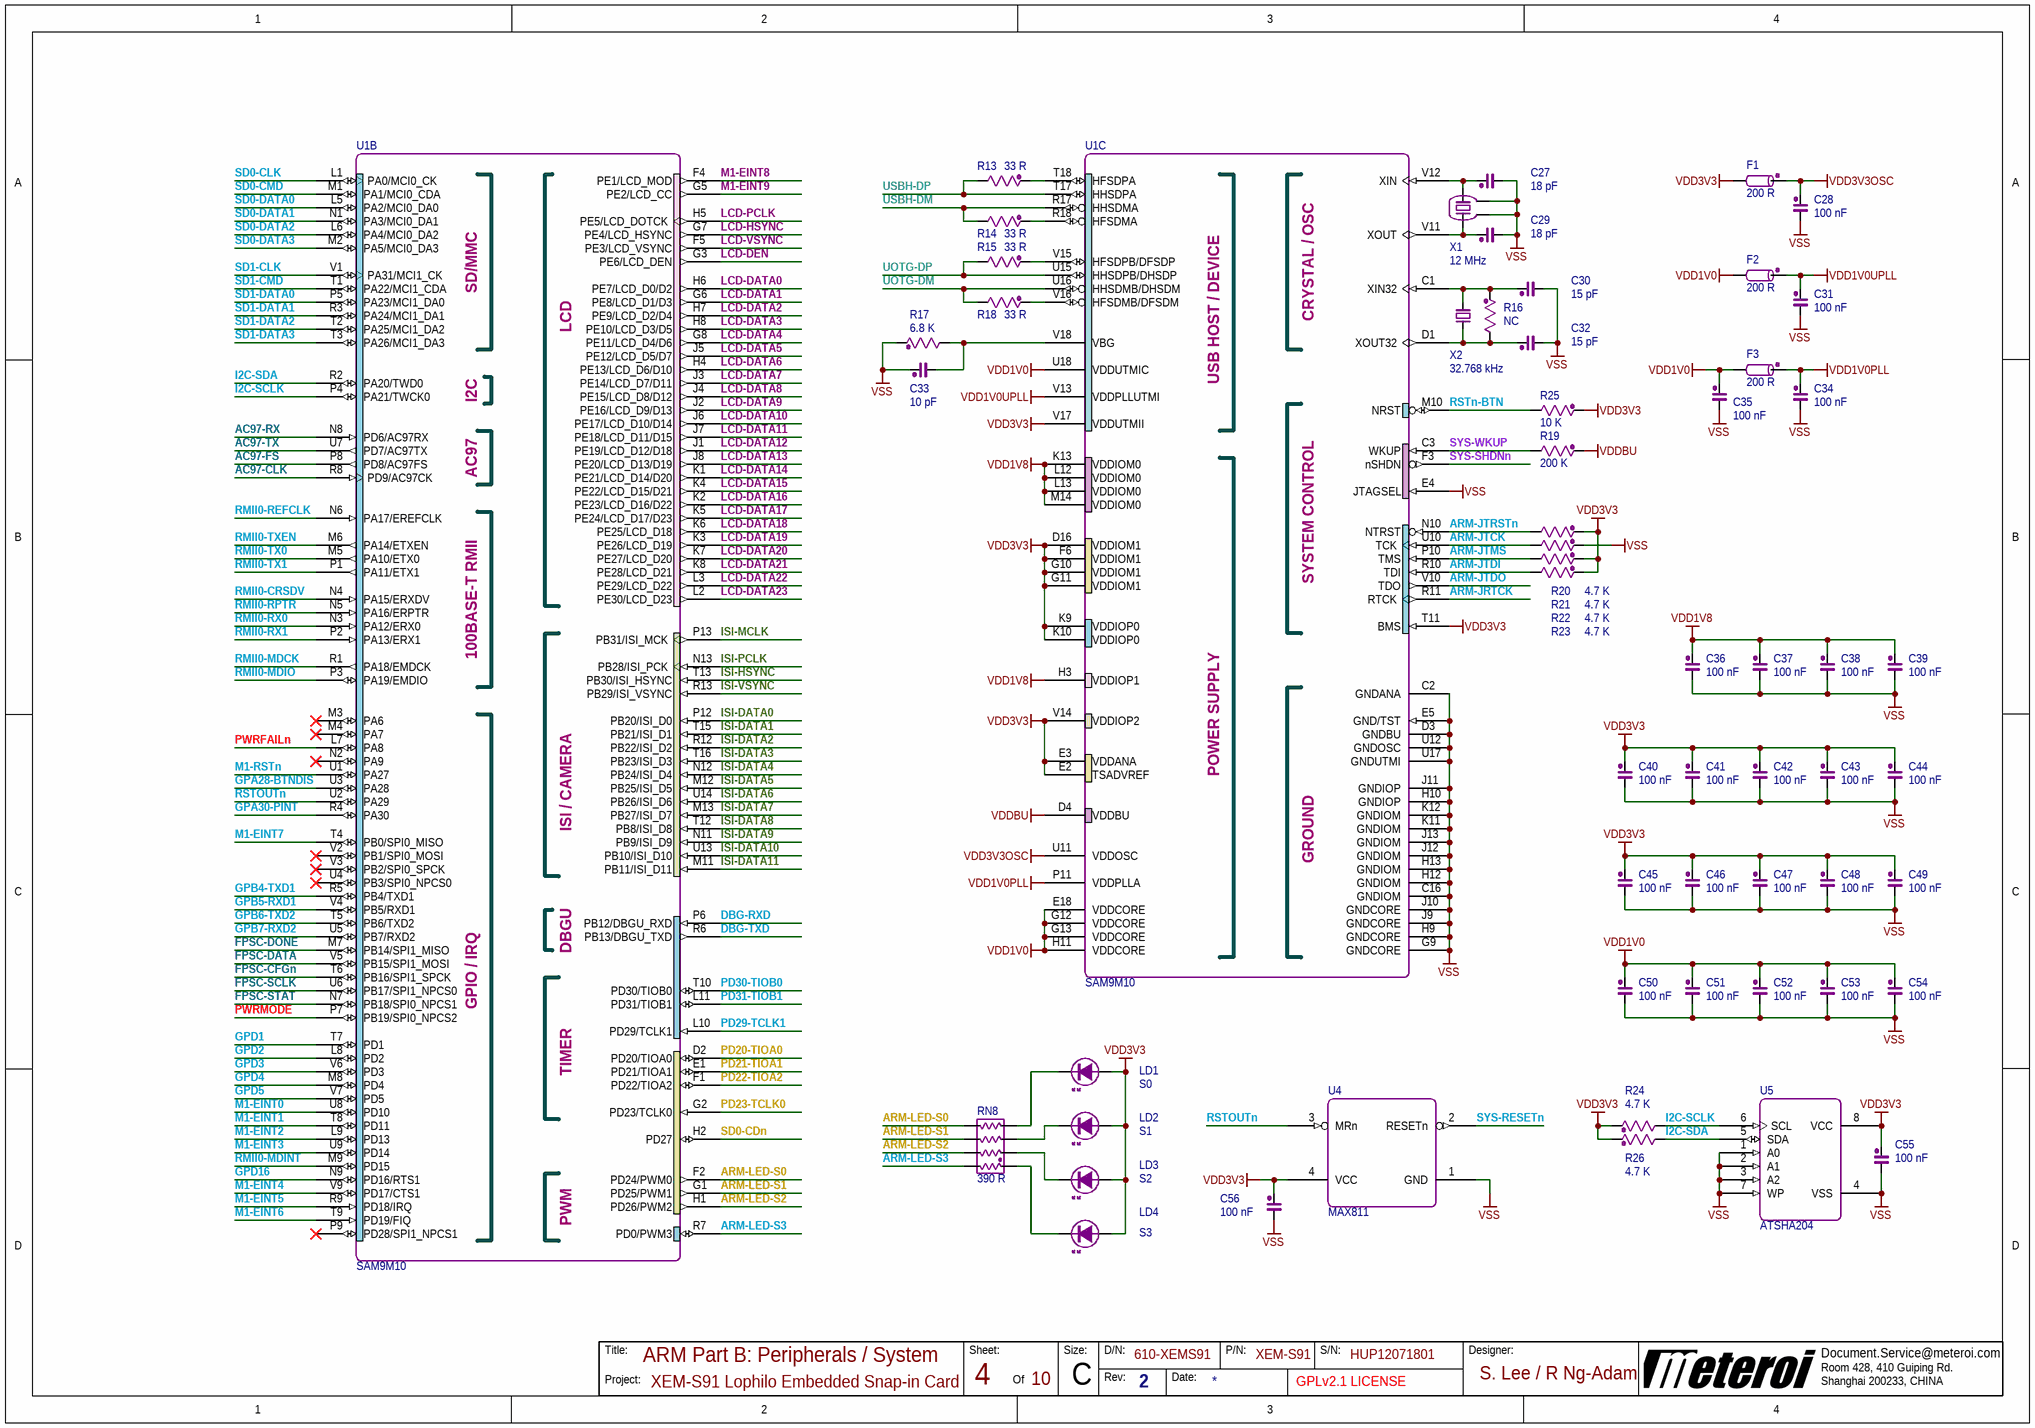
[diagram p3: 04_ARM_B.SchDoc]

### Parts
C27  18 pF  [0402A1]
C28  100 nF  [0402A1]
C29  18 pF  [0402A1]
C30  15 pF  [0402A1]
C31  100 nF  [0402A1]
C32  15 pF  [0402A1]
C33  10 pF  [0402A1]
C34  100 nF  [0402A1]
C35  100 nF  [0402A1]
C36  100 nF  [0402A1]
C37  100 nF  [0402A1]
C38  100 nF  [0402A1]
C39  100 nF  [0402A1]
C40  100 nF  [0402A1]
C41  100 nF  [0402A1]
C42  100 nF  [0402A1]
C43  100 nF  [0402A1]
C44  100 nF  [0402A1]
C45  100 nF  [0402A1]
C46  100 nF  [0402A1]
C47  100 nF  [0402A1]
C48  100 nF  [0402A1]
C49  100 nF  [0402A1]
C50  100 nF  [0402A1]
C51  100 nF  [0402A1]
C52  100 nF  [0402A1]
C53  100 nF  [0402A1]
C54  100 nF  [0402A1]
C55  100 nF  [0402A1]
C56  100 nF  [0402A1]
F1  200 R  [0402A3]
F2  200 R  [0402A3]
F3  200 R  [0402A3]
LD1  S0  [0603LD]
LD2  S1  [0603LD]
LD3  S2  [0603LD]
LD4  S3  [0603LD]
R13  33 R  [0402A2]
R14  33 R  [0402A2]
R15  33 R  [0402A2]
R16  NC  [0402A2]
R17  6.8 K  [0402A2]
R18  33 R  [0402A2]
R19  200 K  [0402A2]
R20  4.7 K  [0402A2]
R21  4.7 K  [0402A2]
R22  4.7 K  [0402A2]
R23  4.7 K  [0402A2]
R24  4.7 K  [0402A2]
R25  10 K  [0402A2]
R26  4.7 K  [0402A2]
RN8  390 R  [0402PR4]
U1  SAM9M10  [TFBGA-324]  (parts B,C of 3)
U4  MAX811  [SOT-143]
U5  ATSHA204  [SOIC-8S]
X1  12 MHz  [OSC_4A_S_3225]
X2  32.768 kHz  [OSC_2A_S_4918]

### Nets
VDD1V0: C35.2 C50.2 C51.2 C52.2 C53.2 C54.2 F2.1 F3.1 U1.E18(VDDCORE) U1.G12(VDDCORE) U1.G13(VDDCORE) U1.H11(VDDCORE) U1.U18(VDDUTMIC)
VDD1V0PLL: C34.2 F3.2 U1.P11(VDDPLLA)
VDD1V0UPLL: C31.2 F2.2 U1.V13(VDDPLLUTMI)
VDD1V8: C36.2 C37.2 C38.2 C39.2 U1.H3(VDDIOP1) U1.K13(VDDIOM0) U1.L12(VDDIOM0) U1.L13(VDDIOM0) U1.M14(VDDIOM0)
VDD3V3: C40.2 C41.2 C42.2 C43.2 C44.2 C45.2 C46.2 C47.2 C48.2 C49.2 C55.2 C56.2 F1.1 LD1.2 LD2.2 LD3.2 LD4.2 R20.2 R22.2 R23.2 R24.2 R25.2 R26.2 U1.D16(VDDIOM1) U1.E2(TSADVREF) U1.E3(VDDANA) U1.F6(VDDIOM1) U1.G10(VDDIOM1) U1.G11(VDDIOM1) U1.K9(VDDIOP0) U1.K10(VDDIOP0) U1.T11(BMS) U1.V14(VDDIOP2) U1.V17(VDDUTMII) U4.4(VCC) U5.8(VCC)
VDD3V3OSC: C28.2 F1.2 U1.U11(VDDOSC)
VDDBU: R19.2 U1.D4(VDDBU)
VSS: C27.1 C28.1 C29.1 C30.1 C31.1 C32.1 C33.2 C34.1 C35.1 C36.1 C37.1 C38.1 C39.1 C40.1 C41.1 C42.1 C43.1 C44.1 C45.1 C46.1 C47.1 C48.1 C49.1 C50.1 C51.1 C52.1 C53.1 C54.1 C55.1 C56.1 R17.2 R21.2 U1.C2(GNDANA) U1.C16(GNDIOM) U1.D3(GNDBU) U1.E4(JTAGSEL) U1.E5(GND/TST) U1.G9(GNDCORE) U1.H9(GNDCORE) U1.H10(GNDIOP) U1.H12(GNDIOM) U1.H13(GNDIOM) U1.J9(GNDCORE) U1.J10(GNDCORE) U1.J11(GNDIOP) U1.J12(GNDIOM) U1.J13(GNDIOM) U1.K11(GNDIOM) U1.K12(GNDIOM) U1.U12(GNDOSC) U1.U17(GNDUTMI) U4.1(GND) U5.1(A0) U5.2(A1) U5.3(A2) U5.4(VSS) U5.7(WP) X1.2 X1.4
AC97-CLK: U1.R8(PD9/AC97CK)
AC97-FS: U1.P8(PD8/AC97FS)
AC97-RX: U1.N8(PD6/AC97RX)
AC97-TX: U1.U7(PD7/AC97TX)
ARM-JRTCK: U1.R11(RTCK)
ARM-JTCK: R21.1 U1.U10(TCK)
ARM-JTDI: R23.1 U1.R10(TDI)
ARM-JTDO: U1.V10(TDO)
ARM-JTMS: R22.1 U1.P10(TMS)
ARM-JTRSTn: R20.1 U1.N10(NTRST)
ARM-LED-S0: RN8.8 U1.F2(PD24/PWM0)
ARM-LED-S1: RN8.6 U1.G1(PD25/PWM1)
ARM-LED-S2: RN8.4 U1.H1(PD26/PWM2)
ARM-LED-S3: RN8.2 U1.R7(PD0/PWM3)
DBG-RXD: U1.P6(PB12/DBGU_RXD)
DBG-TXD: U1.R6(PB13/DBGU_TXD)
FPSC-CFGn: U1.T6(PB16/SPI1_SPCK)
FPSC-DATA: U1.V5(PB15/SPI1_MOSI)
FPSC-DONE: U1.M7(PB14/SPI1_MISO)
FPSC-SCLK: U1.U6(PB17/SPI1_NPCS0)
FPSC-STAT: U1.N7(PB18/SPI0_NPCS1)
GPA28-BTNDIS: U1.U3(PA28)
GPA30-PINT: U1.R4(PA30)
GPB4-TXD1: U1.R5(PB4/TXD1)
GPB5-RXD1: U1.V4(PB5/RXD1)
GPB6-TXD2: U1.T5(PB6/TXD2)
GPB7-RXD2: U1.U5(PB7/RXD2)
GPD1: U1.T7(PD1)
GPD2: U1.L8(PD2)
GPD3: U1.V6(PD3)
GPD4: U1.M8(PD4)
GPD5: U1.V7(PD5)
GPD16: U1.N9(PD16/RTS1)
I2C-SCLK: R24.1 U1.P4(PA21/TWCK0) U5.6(SCL)
I2C-SDA: R26.1 U1.R2(PA20/TWD0) U5.5(SDA)
ISI-DATA0: U1.P12(PB20/ISI_D0)
ISI-DATA1: U1.T15(PB21/ISI_D1)
ISI-DATA2: U1.R12(PB22/ISI_D2)
ISI-DATA3: U1.T16(PB23/ISI_D3)
ISI-DATA4: U1.N12(PB24/ISI_D4)
ISI-DATA5: U1.M12(PB25/ISI_D5)
ISI-DATA6: U1.U14(PB26/ISI_D6)
ISI-DATA7: U1.M13(PB27/ISI_D7)
ISI-DATA8: U1.T12(PB8/ISI_D8)
ISI-DATA9: U1.N11(PB9/ISI_D9)
ISI-DATA10: U1.U13(PB10/ISI_D10)
ISI-DATA11: U1.M11(PB11/ISI_D11)
ISI-HSYNC: U1.T13(PB30/ISI_HSYNC)
ISI-MCLK: U1.P13(PB31/ISI_MCK)
ISI-PCLK: U1.N13(PB28/ISI_PCK)
ISI-VSYNC: U1.R13(PB29/ISI_VSYNC)
LCD-DATA0: U1.H6(PE7/LCD_D0/D2)
LCD-DATA1: U1.G6(PE8/LCD_D1/D3)
LCD-DATA2: U1.H7(PE9/LCD_D2/D4)
LCD-DATA3: U1.H8(PE10/LCD_D3/D5)
LCD-DATA4: U1.G8(PE11/LCD_D4/D6)
LCD-DATA5: U1.J5(PE12/LCD_D5/D7)
LCD-DATA6: U1.H4(PE13/LCD_D6/D10)
LCD-DATA7: U1.J3(PE14/LCD_D7/D11)
LCD-DATA8: U1.J4(PE15/LCD_D8/D12)
LCD-DATA9: U1.J2(PE16/LCD_D9/D13)
LCD-DATA10: U1.J6(PE17/LCD_D10/D14)
LCD-DATA11: U1.J7(PE18/LCD_D11/D15)
LCD-DATA12: U1.J1(PE19/LCD_D12/D18)
LCD-DATA13: U1.J8(PE20/LCD_D13/D19)
LCD-DATA14: U1.K1(PE21/LCD_D14/D20)
LCD-DATA15: U1.K4(PE22/LCD_D15/D21)
LCD-DATA16: U1.K2(PE23/LCD_D16/D22)
LCD-DATA17: U1.K5(PE24/LCD_D17/D23)
LCD-DATA18: U1.K6(PE25/LCD_D18)
LCD-DATA19: U1.K3(PE26/LCD_D19)
LCD-DATA20: U1.K7(PE27/LCD_D20)
LCD-DATA21: U1.K8(PE28/LCD_D21)
LCD-DATA22: U1.L3(PE29/LCD_D22)
LCD-DATA23: U1.L2(PE30/LCD_D23)
LCD-DEN: U1.G3(PE6/LCD_DEN)
LCD-HSYNC: U1.G7(PE4/LCD_HSYNC)
LCD-PCLK: U1.H5(PE5/LCD_DOTCK)
LCD-VSYNC: U1.F5(PE3/LCD_VSYNC)
M1-EINT0: U1.U8(PD10)
M1-EINT1: U1.T8(PD11)
M1-EINT2: U1.L9(PD13)
M1-EINT3: U1.U9(PD14)
M1-EINT4: U1.V9(PD17/CTS1)
M1-EINT5: U1.R9(PD18/IRQ)
M1-EINT6: U1.T9(PD19/FIQ)
M1-EINT7: U1.T4(PB0/SPI0_MISO)
M1-EINT8: U1.F4(PE1/LCD_MOD)
M1-EINT9: U1.G5(PE2/LCD_CC)
M1-RSTn: U1.U1(PA27)
PD20-TIOA0: U1.D2(PD20/TIOA0)
PD21-TIOA1: U1.E1(PD21/TIOA1)
PD22-TIOA2: U1.F1(PD22/TIOA2)
PD23-TCLK0: U1.G2(PD23/TCLK0)
PD29-TCLK1: U1.L10(PD29/TCLK1)
PD30-TIOB0: U1.T10(PD30/TIOB0)
PD31-TIOB1: U1.L11(PD31/TIOB1)
PWRFAILn: U1.L7(PA8)
PWRMODE: U1.P7(PB19/SPI0_NPCS2)
RMII0-CRSDV: U1.N4(PA15/ERXDV)
RMII0-MDCK: U1.R1(PA18/EMDCK)
RMII0-MDINT: U1.M9(PD15)
RMII0-MDIO: U1.P3(PA19/EMDIO)
RMII0-REFCLK: U1.N6(PA17/EREFCLK)
RMII0-RPTR: U1.N5(PA16/ERPTR)
RMII0-RX0: U1.N3(PA12/ERX0)
RMII0-RX1: U1.P2(PA13/ERX1)
RMII0-TX0: U1.M5(PA10/ETX0)
RMII0-TX1: U1.P1(PA11/ETX1)
RMII0-TXEN: U1.M6(PA14/ETXEN)
RSTn-BTN: R25.1 U1.M10(NRST)
RSTOUTn: U1.U2(PA29) U4.3(MRn)
SD0-CDn: U1.H2(PD27)
SD0-CLK: U1.L1(PA0/MCI0_CK)
SD0-CMD: U1.M1(PA1/MCI0_CDA)
SD0-DATA0: U1.L5(PA2/MCI0_DA0)
SD0-DATA1: U1.N1(PA3/MCI0_DA1)
SD0-DATA2: U1.L6(PA4/MCI0_DA2)
SD0-DATA3: U1.M2(PA5/MCI0_DA3)
SD1-CLK: U1.V1(PA31/MCI1_CK)
SD1-CMD: U1.T1(PA22/MCI1_CDA)
SD1-DATA0: U1.P5(PA23/MCI1_DA0)
SD1-DATA1: U1.R3(PA24/MCI1_DA1)
SD1-DATA2: U1.T2(PA25/MCI1_DA2)
SD1-DATA3: U1.T3(PA26/MCI1_DA3)
SYS-RESETn: U4.2(RESETn)
SYS-SHDNn: U1.F3(nSHDN)
SYS-WKUP: R19.1 U1.C3(WKUP)
UOTG-DM: R18.1 U1.U16(HHSDMB/DHSDM)
UOTG-DP: R15.1 U1.U15(HHSDPB/DHSDP)
USBH-DM: R14.1 U1.R17(HHSDMA)
USBH-DP: R13.1 U1.T17(HHSDPA)
NetC27_2: C27.2 U1.V12(XIN) X1.1
NetC29_2: C29.2 U1.V11(XOUT) X1.3
NetC30_2: C30.2 R16.2 U1.C1(XIN32) X2.2
NetC32_2: C32.2 R16.1 U1.D1(XOUT32) X2.1
NetC33_1: C33.1 R17.1 U1.V18(VBG)
NetLD1_1: LD1.1 RN8.7
NetLD2_1: LD2.1 RN8.5
NetLD3_1: LD3.1 RN8.3
NetLD4_1: LD4.1 RN8.1
NetR13_2: R13.2 U1.T18(HFSDPA)
NetR14_2: R14.2 U1.R18(HFSDMA)
NetR15_2: R15.2 U1.V15(HFSDPB/DFSDP)
NetR18_2: R18.2 U1.V16(HFSDMB/DFSDM)

Not connected (* = marked no-connect by the designer): U1 M3(PA6)* M4(PA7)* N2(PA9)* P9(PD28/SPI1_NPCS1)* U4(PB3/SPI0_NPCS0)* V2(PB1/SPI0_MOSI)* V3(PB2/SPI0_SPCK)*

### Notes on the sheet
- Title:
- Project:
- Sheet:
- Of
- Size:
- D/N:
- Rev:
- Date:
- P/N:
- S/N:
- Designer:
- C
- (in symbol SAM9M10, part B) SD/MMC; LCD; I2C; AC97; 100BASE-T RMII; ISI / CAMERA; DBGU; GPIO / IRQ; TIMER; PWM
- (in symbol SAM9M10, part C) CRYSTAL / OSC; USB HOST / DEVICE; SYSTEM CONTROL; POWER SUPPLY; GROUND

### Library data of the parts
C27-C56 = CAP: as C1 on sheet 02_XEM; SerialNumber: 0; Publisher: Cowin; PCBMarker: Capacitor; Version: 1.0; VersionDate: 04-27-2011; PinCountHole: 0
  C27 C29: Value: 18 pF
  C28 C31 C34-C56: Value: 100 nF
  C30 C32: Value: 15 pF
  C33: Value: 10 pF
F1-F3 = BEAD: EMI Bead; PartNumber: BLM; SerialNumber: 0; Vendor: muRata; Designer: shyul; PinCountSMD: 2; PCBMarker: Bead; Version: 1.0; Value: 200 R; VersionDate: 04-28-2011; Publisher: Cowin; PinCountHole: 0
LD1-LD4 = LED: LED Single; PartNumber: 0; Value: Red; Designer: shyul; Vendor: Luckylight; PinCountSMD: 2; Status: S0; Version: 1.0; Publisher: Cowin; SerialNumber: 0; VersionDate: 04-27-2011; PCBMarker: LED; PinCountHole: 0
R13-R26 = RES: as R1 on sheet 02_XEM; SerialNumber: 0; Version: 1.0; VersionDate: 04-27-2011; PCBMarker: Resistor; Publisher: Cowin; PinCountHole: 0
  R13-R15 R18: Value: 33 R
  R16: Value: NC
  R17: Value: 6.8 K
  R19: Value: 200 K
  R20-R24 R26: Value: 4.7 K
  R25: Value: 10 K
RN8 = RES_N4: Resistor Array x4; PartNumber: YC124-JR-07390RL; SerialNumber: 0; Vendor: YAGEO; Designer: shyul; PinCountSMD: 8; Value: 390 R; Version: 1.0; VersionDate: 04-27-2011; Publisher: Cowin; PCBMarker: Resistor Array; PinCountHole: 0
U1 = SAM9M10: as U1 on sheet 03_ARM_A; Version: 1.0; VersionDate: 2-15-2012; Value: SAM9M10; Publisher: Cowin
U4 = MAX811: Generic nReset; PartNumber: MAX811SEUS-T; Vendor: Maxim Semi.; SerialNumber: 0; PCBMarker: RESET; PinCountSMD: 4; Designer: shyul; Value: MAX811; Version: 1.0; VersionDate: 05-18-2011; Publisher: Cowin; PinCountHole: 0
U5 = ROM_I2C_A: Generic 24 Series I2C ROM; PartNumber: ATSHA204-SH-DA; Vendor: Atmel; SerialNumber: 0; PCBMarker: I2C ROM; PinCountSMD: 8; Designer: shyul; Version: 1.0; VersionDate: 05-08-2011; Publisher: Cowin; PinCountHole: 0; Value: ATSHA204
X1 = OSC_2B: Crystal; PartNumber: 0; Vendor: KDS; Designer: shyul; PinCountSMD: 4; Value: 12 MHz; SerialNumber: 0; Publisher: Cowin; PCBMarker: Crystal; Version: 1.0; VersionDate: 04-29-2011; PinCountHole: 0
X2 = OSC_2A: Crystal; PartNumber: 0; Vendor: KDS; Designer: shyul; PinCountSMD: 2; Value: 32.768 kHz; SerialNumber: 0; Publisher: Cowin; PCBMarker: Crystal; Version: 1.0; VersionDate: 04-29-2011; PinCountHole: 0

## Sheet 05_FPGA_A.SchDoc: FPGA Part A: Bank 1-2
size 381 x 266 mm; Organization: Meteroi; Address1: Room 428, 410 Guiping Rd.; Address2: Shanghai 200233, CHINA; SheetNumber: 6; SheetTotal: 11; PageSetup: Record=PageOptions|CenterHorizontal=True|CenterVertical=True|PrintScale=0.75|XCorrection=1.00|YCorrection=1.00|PrintKind=2|BorderSize=5000000|LeftOffset=0|BottomOffset=0|Orientation=2|PaperLength=1000|PaperWidth=1000|Scale=100|PaperSource=276|PrintQuality=-3|MediaType=1|DitherType=10|PaperKind=A4|PrintScaleMode=1
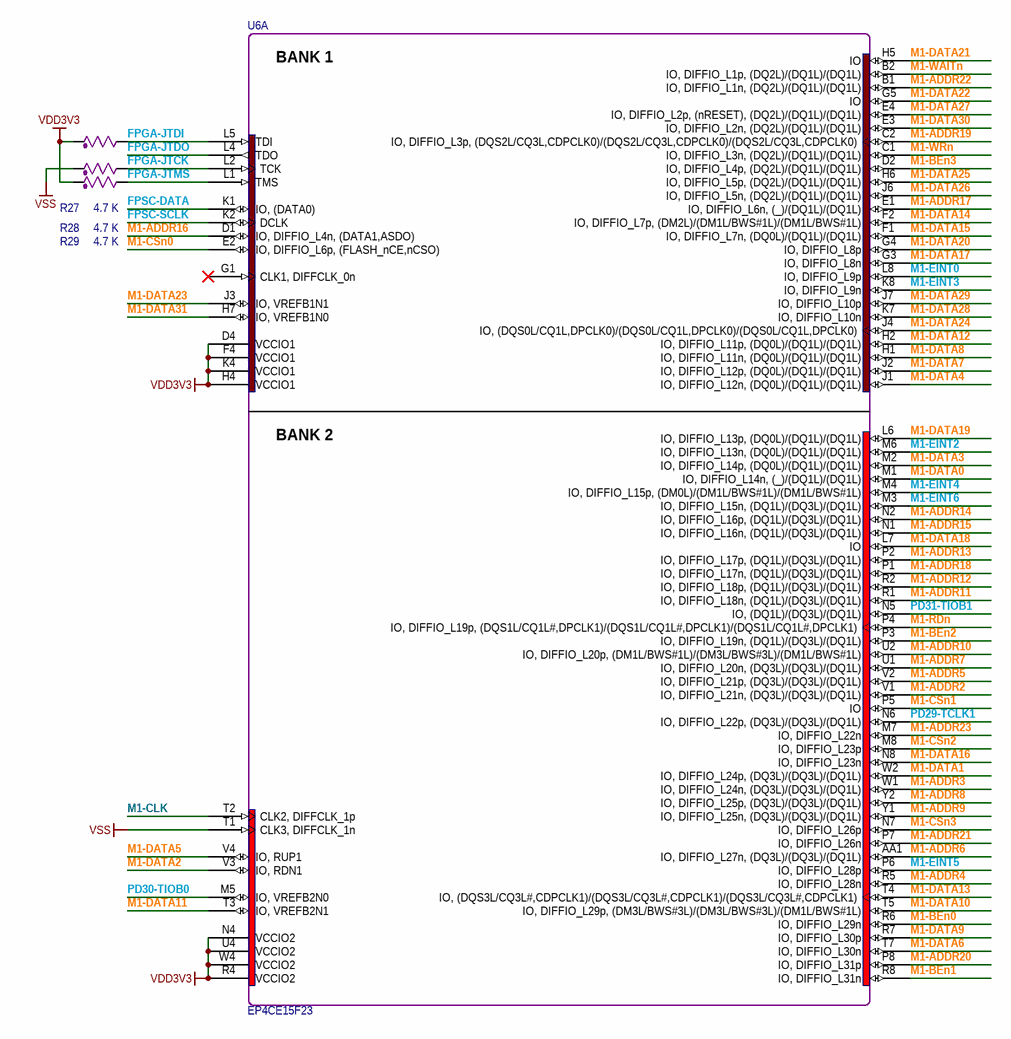
[diagram p4: 05_FPGA_A.SchDoc]

### Parts
R27  4.7 K  [0402A2]
R28  4.7 K  [0402A2]
R29  4.7 K  [0402A2]
U6  EP4CE15F23  [FBGA-484]  (part A of 5)

### Nets
VDD3V3: R27.2 R29.2 U6.D4(VCCIO1) U6.F4(VCCIO1) U6.H4(VCCIO1) U6.K4(VCCIO1) U6.N4(VCCIO2) U6.R4(VCCIO2) U6.U4(VCCIO2) U6.W4(VCCIO2)
VSS: R28.2 U6.T1(CLK3,_DIFFCLK_1n)
FPGA-JTCK: R28.1 U6.L2(TCK)
FPGA-JTDI: R27.1 U6.L5(TDI)
FPGA-JTDO: U6.L4(TDO)
FPGA-JTMS: R29.1 U6.L1(TMS)
FPSC-DATA: U6.K1(IO,_(DATA0))
FPSC-SCLK: U6.K2(DCLK)
M1-ADDR2: U6.V1(IO,_DIFFIO_L21n,_(DQ3L)/(DQ3L)/(DQ1L))
M1-ADDR3: U6.W1(IO,_DIFFIO_L24n,_(DQ3L)/(DQ3L)/(DQ1L))
M1-ADDR4: U6.R5(IO,_DIFFIO_L28n)
M1-ADDR5: U6.V2(IO,_DIFFIO_L21p,_(DQ3L)/(DQ3L)/(DQ1L))
M1-ADDR6: U6.AA1(IO,_DIFFIO_L27n,_(DQ3L)/(DQ3L)/(DQ1L))
M1-ADDR7: U6.U1(IO,_DIFFIO_L20n,_(DQ3L)/(DQ3L)/(DQ1L))
M1-ADDR8: U6.Y2(IO,_DIFFIO_L25p,_(DQ3L)/(DQ3L)/(DQ1L))
M1-ADDR9: U6.Y1(IO,_DIFFIO_L25n,_(DQ3L)/(DQ3L)/(DQ1L))
M1-ADDR10: U6.U2(IO,_DIFFIO_L20p,_(DM1L/BWS#1L)/(DM3L/BWS#3L)/(DM1L/BWS#1L))
M1-ADDR11: U6.R1(IO,_DIFFIO_L18n,_(DQ1L)/(DQ3L)/(DQ1L))
M1-ADDR12: U6.R2(IO,_DIFFIO_L18p,_(DQ1L)/(DQ3L)/(DQ1L))
M1-ADDR13: U6.P2(IO,_DIFFIO_L17p,_(DQ1L)/(DQ3L)/(DQ1L))
M1-ADDR14: U6.N2(IO,_DIFFIO_L16p,_(DQ1L)/(DQ3L)/(DQ1L))
M1-ADDR15: U6.N1(IO,_DIFFIO_L16n,_(DQ1L)/(DQ3L)/(DQ1L))
M1-ADDR16: U6.D1(IO,_DIFFIO_L4n,_(DATA1,ASDO))
M1-ADDR17: U6.E1(IO,_DIFFIO_L6n,_(_)/(DQ1L)/(DQ1L))
M1-ADDR18: U6.P1(IO,_DIFFIO_L17n,_(DQ1L)/(DQ3L)/(DQ1L))
M1-ADDR19: U6.C2(IO,_DIFFIO_L3p,_(DQS2L/CQ3L,CDPCLK0)/(DQS2L/CQ3L,CDPCLK0)/(DQS2L/CQ3L,CDPCLK0))
M1-ADDR20: U6.P8(IO,_DIFFIO_L31p)
M1-ADDR21: U6.P7(IO,_DIFFIO_L26n)
M1-ADDR22: U6.B1(IO,_DIFFIO_L1n,_(DQ2L)/(DQ1L)/(DQ1L))
M1-ADDR23: U6.M7(IO,_DIFFIO_L22n)
M1-BEn0: U6.R6(IO,_DIFFIO_L29n)
M1-BEn1: U6.R8(IO,_DIFFIO_L31n)
M1-BEn2: U6.P3(IO,_DIFFIO_L19n,_(DQ1L)/(DQ3L)/(DQ1L))
M1-BEn3: U6.D2(IO,_DIFFIO_L4p,_(DQ2L)/(DQ1L)/(DQ1L))
M1-CLK: U6.T2(CLK2,_DIFFCLK_1p)
M1-CSn0: U6.E2(IO,_DIFFIO_L6p,_(FLASH_nCE,nCSO))
M1-CSn1: U6.P5(IO)
M1-CSn2: U6.M8(IO,_DIFFIO_L23p)
M1-CSn3: U6.N7(IO,_DIFFIO_L26p)
M1-DATA0: U6.M1(IO,_DIFFIO_L14n,_(_)/(DQ1L)/(DQ1L))
M1-DATA1: U6.W2(IO,_DIFFIO_L24p,_(DQ3L)/(DQ3L)/(DQ1L))
M1-DATA2: U6.V3(IO,_RDN1)
M1-DATA3: U6.M2(IO,_DIFFIO_L14p,_(DQ0L)/(DQ1L)/(DQ1L))
M1-DATA4: U6.J1(IO,_DIFFIO_L12n,_(DQ0L)/(DQ1L)/(DQ1L))
M1-DATA5: U6.V4(IO,_RUP1)
M1-DATA6: U6.T7(IO,_DIFFIO_L30n)
M1-DATA7: U6.J2(IO,_DIFFIO_L12p,_(DQ0L)/(DQ1L)/(DQ1L))
M1-DATA8: U6.H1(IO,_DIFFIO_L11n,_(DQ0L)/(DQ1L)/(DQ1L))
M1-DATA9: U6.R7(IO,_DIFFIO_L30p)
M1-DATA10: U6.T5(IO,_DIFFIO_L29p,_(DM3L/BWS#3L)/(DM3L/BWS#3L)/(DM1L/BWS#1L))
M1-DATA11: U6.T3(IO,_VREFB2N1)
M1-DATA12: U6.H2(IO,_DIFFIO_L11p,_(DQ0L)/(DQ1L)/(DQ1L))
M1-DATA13: U6.T4(IO,_(DQS3L/CQ3L#,CDPCLK1)/(DQS3L/CQ3L#,CDPCLK1)/(DQS3L/CQ3L#,CDPCLK1))
M1-DATA14: U6.F2(IO,_DIFFIO_L7p,_(DM2L)/(DM1L/BWS#1L)/(DM1L/BWS#1L))
M1-DATA15: U6.F1(IO,_DIFFIO_L7n,_(DQ0L)/(DQ1L)/(DQ1L))
M1-DATA16: U6.N8(IO,_DIFFIO_L23n)
M1-DATA17: U6.G3(IO,_DIFFIO_L8n)
M1-DATA18: U6.L7(IO)
M1-DATA19: U6.L6(IO,_DIFFIO_L13p,_(DQ0L)/(DQ1L)/(DQ1L))
M1-DATA20: U6.G4(IO,_DIFFIO_L8p)
M1-DATA21: U6.H5(IO)
M1-DATA22: U6.G5(IO)
M1-DATA23: U6.J3(IO,_VREFB1N1)
M1-DATA24: U6.J4(IO,_(DQS0L/CQ1L,DPCLK0)/(DQS0L/CQ1L,DPCLK0)/(DQS0L/CQ1L,DPCLK0))
M1-DATA25: U6.H6(IO,_DIFFIO_L5p,_(DQ2L)/(DQ1L)/(DQ1L))
M1-DATA26: U6.J6(IO,_DIFFIO_L5n,_(DQ2L)/(DQ1L)/(DQ1L))
M1-DATA27: U6.E4(IO,_DIFFIO_L2p,_(nRESET),_(DQ2L)/(DQ1L)/(DQ1L))
M1-DATA28: U6.K7(IO,_DIFFIO_L10n)
M1-DATA29: U6.J7(IO,_DIFFIO_L10p)
M1-DATA30: U6.E3(IO,_DIFFIO_L2n,_(DQ2L)/(DQ1L)/(DQ1L))
M1-DATA31: U6.H7(IO,_VREFB1N0)
M1-EINT0: U6.L8(IO,_DIFFIO_L9p)
M1-EINT2: U6.M6(IO,_DIFFIO_L13n,_(DQ0L)/(DQ1L)/(DQ1L))
M1-EINT3: U6.K8(IO,_DIFFIO_L9n)
M1-EINT4: U6.M4(IO,_DIFFIO_L15p,_(DM0L)/(DM1L/BWS#1L)/(DM1L/BWS#1L))
M1-EINT5: U6.P6(IO,_DIFFIO_L28p)
M1-EINT6: U6.M3(IO,_DIFFIO_L15n,_(DQ1L)/(DQ3L)/(DQ1L))
M1-RDn: U6.P4(IO,_DIFFIO_L19p,_(DQS1L/CQ1L#,DPCLK1)/(DQS1L/CQ1L#,DPCLK1)/(DQS1L/CQ1L#,DPCLK1))
M1-WAITn: U6.B2(IO,_DIFFIO_L1p,_(DQ2L)/(DQ1L)/(DQ1L))
M1-WRn: U6.C1(IO,_DIFFIO_L3n,_(DQ2L)/(DQ1L)/(DQ1L))
PD29-TCLK1: U6.N6(IO,_DIFFIO_L22p,_(DQ3L)/(DQ3L)/(DQ1L))
PD30-TIOB0: U6.M5(IO,_VREFB2N0)
PD31-TIOB1: U6.N5(IO,_(DQ1L)/(DQ3L)/(DQ1L))

Not connected (* = marked no-connect by the designer): U6 G1(CLK1,_DIFFCLK_0n)*

### Notes on the sheet
- Title:
- Project:
- Sheet:
- Of
- Size:
- D/N:
- Rev:
- Date:
- P/N:
- S/N:
- Designer:
- C
- (in symbol EP4CE15F23, part A) BANK 1; BANK 2

### Library data of the parts
R27-R29 = RES: as R1 on sheet 02_XEM; SerialNumber: 0; Value: 4.7 K; Version: 1.0; VersionDate: 04-27-2011; PCBMarker: Resistor; Publisher: Cowin; PinCountHole: 0
U6 = EP4CE15F23: Cyclone IV EP4CE15F23 FPGA; PartNumber: EP4CE15F23C8N; SerialNumber: 0; Vendor: Altera; Designer: shyul; PCBMarker: FPGA; Version: 1.0; VersionDate: 2-17-2012; Value: EP4CE15F23; Publisher: Cowin

## Sheet 06_FPGA_B.SchDoc: FPGA Part B: Bank 3-4
size 381 x 266 mm; Organization: Meteroi; Address1: Room 428, 410 Guiping Rd.; Address2: Shanghai 200233, CHINA; SheetNumber: 7; SheetTotal: 11; PageSetup: Record=PageOptions|CenterHorizontal=True|CenterVertical=True|PrintScale=0.75|XCorrection=1.00|YCorrection=1.00|PrintKind=2|BorderSize=5000000|LeftOffset=0|BottomOffset=0|Orientation=2|PaperLength=1000|PaperWidth=1000|Scale=100|PaperSource=276|PrintQuality=-3|MediaType=1|DitherType=10|PaperKind=A4|PrintScaleMode=1
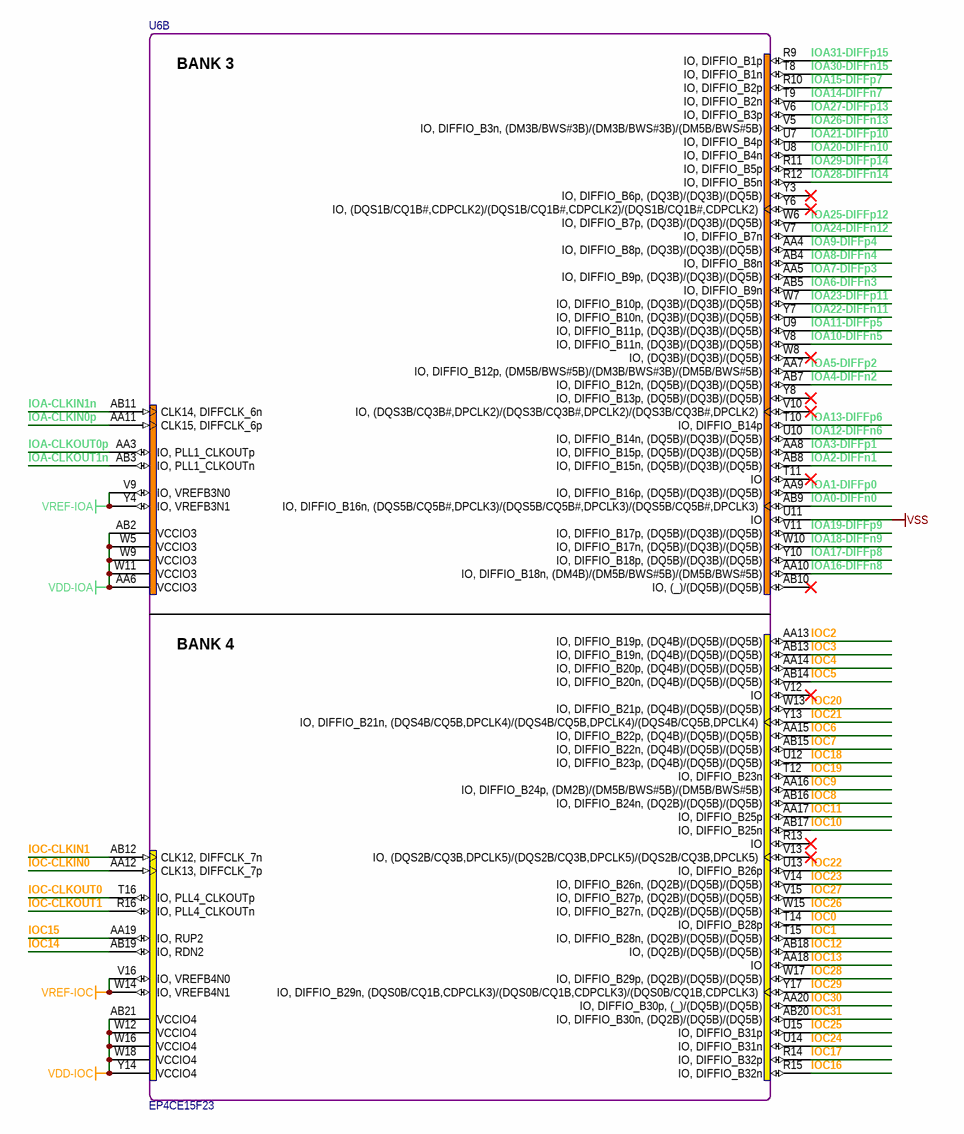
[diagram p5: 06_FPGA_B.SchDoc]

### Parts
U6  EP4CE15F23  [FBGA-484]  (part B of 5)

### Nets
VDD-IOA: U6.AA6(VCCIO3) U6.AB2(VCCIO3) U6.W5(VCCIO3) U6.W9(VCCIO3) U6.W11(VCCIO3)
VDD-IOC: U6.AB21(VCCIO4) U6.W12(VCCIO4) U6.W16(VCCIO4) U6.W18(VCCIO4) U6.Y14(VCCIO4)
VREF-IOA: U6.V9(IO,_VREFB3N0) U6.Y4(IO,_VREFB3N1)
VREF-IOC: U6.V16(IO,_VREFB4N0) U6.W14(IO,_VREFB4N1)
VSS: U6.U11(IO)
IOA0-DIFFn0: U6.AB9(IO,_DIFFIO_B16n,_(DQS5B/CQ5B#,DPCLK3)/(DQS5B/CQ5B#,DPCLK3)/(DQS5B/CQ5B#,DPCLK3))
IOA1-DIFFp0: U6.AA9(IO,_DIFFIO_B16p,_(DQ5B)/(DQ3B)/(DQ5B))
IOA2-DIFFn1: U6.AB8(IO,_DIFFIO_B15n,_(DQ5B)/(DQ3B)/(DQ5B))
IOA3-DIFFp1: U6.AA8(IO,_DIFFIO_B15p,_(DQ5B)/(DQ3B)/(DQ5B))
IOA4-DIFFn2: U6.AB7(IO,_DIFFIO_B12n,_(DQ5B)/(DQ3B)/(DQ5B))
IOA5-DIFFp2: U6.AA7(IO,_DIFFIO_B12p,_(DM5B/BWS#5B)/(DM3B/BWS#3B)/(DM5B/BWS#5B))
IOA6-DIFFn3: U6.AB5(IO,_DIFFIO_B9n)
IOA7-DIFFp3: U6.AA5(IO,_DIFFIO_B9p,_(DQ3B)/(DQ3B)/(DQ5B))
IOA8-DIFFn4: U6.AB4(IO,_DIFFIO_B8n)
IOA9-DIFFp4: U6.AA4(IO,_DIFFIO_B8p,_(DQ3B)/(DQ3B)/(DQ5B))
IOA10-DIFFn5: U6.V8(IO,_DIFFIO_B11n,_(DQ3B)/(DQ3B)/(DQ5B))
IOA11-DIFFp5: U6.U9(IO,_DIFFIO_B11p,_(DQ3B)/(DQ3B)/(DQ5B))
IOA12-DIFFn6: U6.U10(IO,_DIFFIO_B14n,_(DQ5B)/(DQ3B)/(DQ5B))
IOA13-DIFFp6: U6.T10(IO,_DIFFIO_B14p)
IOA14-DIFFn7: U6.T9(IO,_DIFFIO_B2n)
IOA15-DIFFp7: U6.R10(IO,_DIFFIO_B2p)
IOA16-DIFFn8: U6.AA10(IO,_DIFFIO_B18n,_(DM4B)/(DM5B/BWS#5B)/(DM5B/BWS#5B))
IOA17-DIFFp8: U6.Y10(IO,_DIFFIO_B18p,_(DQ5B)/(DQ3B)/(DQ5B))
IOA18-DIFFn9: U6.W10(IO,_DIFFIO_B17n,_(DQ5B)/(DQ3B)/(DQ5B))
IOA19-DIFFp9: U6.V11(IO,_DIFFIO_B17p,_(DQ5B)/(DQ3B)/(DQ5B))
IOA20-DIFFn10: U6.U8(IO,_DIFFIO_B4n)
IOA21-DIFFp10: U6.U7(IO,_DIFFIO_B4p)
IOA22-DIFFn11: U6.Y7(IO,_DIFFIO_B10n,_(DQ3B)/(DQ3B)/(DQ5B))
IOA23-DIFFp11: U6.W7(IO,_DIFFIO_B10p,_(DQ3B)/(DQ3B)/(DQ5B))
IOA24-DIFFn12: U6.V7(IO,_DIFFIO_B7n)
IOA25-DIFFp12: U6.W6(IO,_DIFFIO_B7p,_(DQ3B)/(DQ3B)/(DQ5B))
IOA26-DIFFn13: U6.V5(IO,_DIFFIO_B3n,_(DM3B/BWS#3B)/(DM3B/BWS#3B)/(DM5B/BWS#5B))
IOA27-DIFFp13: U6.V6(IO,_DIFFIO_B3p)
IOA28-DIFFn14: U6.R12(IO,_DIFFIO_B5n)
IOA29-DIFFp14: U6.R11(IO,_DIFFIO_B5p)
IOA30-DIFFn15: U6.T8(IO,_DIFFIO_B1n)
IOA31-DIFFp15: U6.R9(IO,_DIFFIO_B1p)
IOA-CLKIN0p: U6.AA11(CLK15,_DIFFCLK_6p)
IOA-CLKIN1n: U6.AB11(CLK14,_DIFFCLK_6n)
IOA-CLKOUT0p: U6.AA3(IO,_PLL1_CLKOUTp)
IOA-CLKOUT1n: U6.AB3(IO,_PLL1_CLKOUTn)
IOC0: U6.T14(IO,_DIFFIO_B28p)
IOC1: U6.T15(IO,_DIFFIO_B28n,_(DQ2B)/(DQ5B)/(DQ5B))
IOC2: U6.AA13(IO,_DIFFIO_B19p,_(DQ4B)/(DQ5B)/(DQ5B))
IOC3: U6.AB13(IO,_DIFFIO_B19n,_(DQ4B)/(DQ5B)/(DQ5B))
IOC4: U6.AA14(IO,_DIFFIO_B20p,_(DQ4B)/(DQ5B)/(DQ5B))
IOC5: U6.AB14(IO,_DIFFIO_B20n,_(DQ4B)/(DQ5B)/(DQ5B))
IOC6: U6.AA15(IO,_DIFFIO_B22p,_(DQ4B)/(DQ5B)/(DQ5B))
IOC7: U6.AB15(IO,_DIFFIO_B22n,_(DQ4B)/(DQ5B)/(DQ5B))
IOC8: U6.AB16(IO,_DIFFIO_B24n,_(DQ2B)/(DQ5B)/(DQ5B))
IOC9: U6.AA16(IO,_DIFFIO_B24p,_(DM2B)/(DM5B/BWS#5B)/(DM5B/BWS#5B))
IOC10: U6.AB17(IO,_DIFFIO_B25n)
IOC11: U6.AA17(IO,_DIFFIO_B25p)
IOC12: U6.AB18(IO,_(DQ2B)/(DQ5B)/(DQ5B))
IOC13: U6.AA18(IO)
IOC14: U6.AB19(IO,_RDN2)
IOC15: U6.AA19(IO,_RUP2)
IOC16: U6.R15(IO,_DIFFIO_B32n)
IOC17: U6.R14(IO,_DIFFIO_B32p)
IOC18: U6.U12(IO,_DIFFIO_B23p,_(DQ4B)/(DQ5B)/(DQ5B))
IOC19: U6.T12(IO,_DIFFIO_B23n)
IOC20: U6.W13(IO,_DIFFIO_B21p,_(DQ4B)/(DQ5B)/(DQ5B))
IOC21: U6.Y13(IO,_DIFFIO_B21n,_(DQS4B/CQ5B,DPCLK4)/(DQS4B/CQ5B,DPCLK4)/(DQS4B/CQ5B,DPCLK4))
IOC22: U6.U13(IO,_DIFFIO_B26p)
IOC23: U6.V14(IO,_DIFFIO_B26n,_(DQ2B)/(DQ5B)/(DQ5B))
IOC24: U6.U14(IO,_DIFFIO_B31n)
IOC25: U6.U15(IO,_DIFFIO_B31p)
IOC26: U6.W15(IO,_DIFFIO_B27n,_(DQ2B)/(DQ5B)/(DQ5B))
IOC27: U6.V15(IO,_DIFFIO_B27p,_(DQ2B)/(DQ5B)/(DQ5B))
IOC28: U6.W17(IO,_DIFFIO_B29p,_(DQ2B)/(DQ5B)/(DQ5B))
IOC29: U6.Y17(IO,_DIFFIO_B29n,_(DQS0B/CQ1B,CDPCLK3)/(DQS0B/CQ1B,CDPCLK3)/(DQS0B/CQ1B,CDPCLK3))
IOC30: U6.AA20(IO,_DIFFIO_B30p,_(_)/(DQ5B)/(DQ5B))
IOC31: U6.AB20(IO,_DIFFIO_B30n,_(DQ2B)/(DQ5B)/(DQ5B))
IOC-CLKIN0: U6.AA12(CLK13,_DIFFCLK_7p)
IOC-CLKIN1: U6.AB12(CLK12,_DIFFCLK_7n)
IOC-CLKOUT0: U6.T16(IO,_PLL4_CLKOUTp)
IOC-CLKOUT1: U6.R16(IO,_PLL4_CLKOUTn)

Not connected (* = marked no-connect by the designer): U6 AB10(IO,_(_)/(DQ5B)/(DQ5B))* R13(IO)* T11(IO)* V10(IO,_(DQS3B/CQ3B#,DPCLK2)/(DQS3B/CQ3B#,DPCLK2)/(DQS3B/CQ3B#,DPCLK2))* V12(IO)* V13(IO,_(DQS2B/CQ3B,DPCLK5)/(DQS2B/CQ3B,DPCLK5)/(DQS2B/CQ3B,DPCLK5))* W8(IO,_(DQ3B)/(DQ3B)/(DQ5B))* Y3(IO,_DIFFIO_B6p,_(DQ3B)/(DQ3B)/(DQ5B))* Y6(IO,_(DQS1B/CQ1B#,CDPCLK2)/(DQS1B/CQ1B#,CDPCLK2)/(DQS1B/CQ1B#,CDPCLK2))* Y8(IO,_DIFFIO_B13p,_(DQ5B)/(DQ3B)/(DQ5B))*

### Notes on the sheet
- Title:
- Project:
- Sheet:
- Of
- Size:
- D/N:
- Rev:
- Date:
- P/N:
- S/N:
- Designer:
- C
- (in symbol EP4CE15F23, part B) BANK 3; BANK 4

### Library data of the parts
U6 = EP4CE15F23: as U6 on sheet 05_FPGA_A; PCBMarker: FPGA; Version: 1.0; VersionDate: 2-17-2012; Value: EP4CE15F23; Publisher: Cowin

## Sheet 07_FPGA_C.SchDoc: FPGA Part C: Bank 5-6
size 381 x 266 mm; Organization: Meteroi; Address1: Room 428, 410 Guiping Rd.; Address2: Shanghai 200233, CHINA; SheetNumber: 8; SheetTotal: 11; PageSetup: Record=PageOptions|CenterHorizontal=True|CenterVertical=True|PrintScale=0.75|XCorrection=1.00|YCorrection=1.00|PrintKind=2|BorderSize=5000000|LeftOffset=0|BottomOffset=0|Orientation=2|PaperLength=1000|PaperWidth=1000|Scale=100|PaperSource=276|PrintQuality=-3|MediaType=1|DitherType=10|PaperKind=A4|PrintScaleMode=1
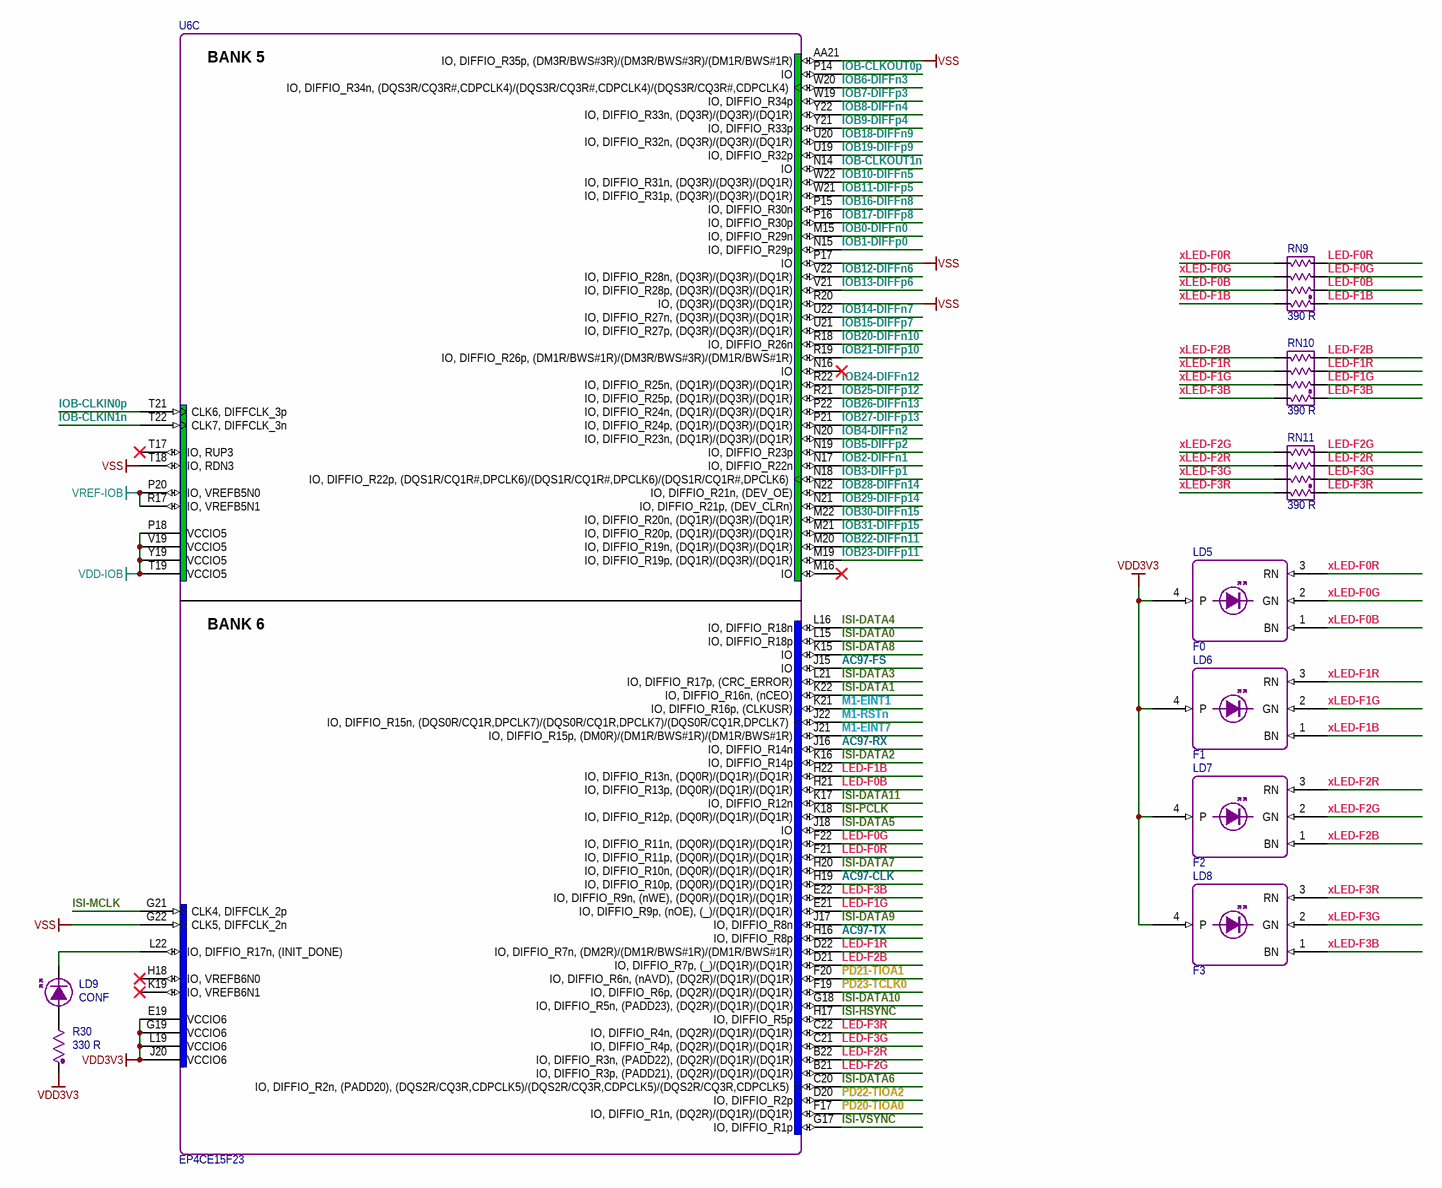
[diagram p6: 07_FPGA_C.SchDoc]

### Parts
LD5  F0  [LED_4B_S_S197]
LD6  F1  [LED_4B_S_S197]
LD7  F2  [LED_4B_S_S197]
LD8  F3  [LED_4B_S_S197]
LD9  CONF  [0603LD]
R30  330 R  [0402A2]
RN9  390 R  [0402PR4]
RN10  390 R  [0402PR4]
RN11  390 R  [0402PR4]
U6  EP4CE15F23  [FBGA-484]  (part C of 5)

### Nets
VDD3V3: LD5.4(P) LD6.4(P) LD7.4(P) LD8.4(P) R30.2 U6.E19(VCCIO6) U6.G19(VCCIO6) U6.J20(VCCIO6) U6.L19(VCCIO6)
VDD-IOB: U6.P18(VCCIO5) U6.T19(VCCIO5) U6.V19(VCCIO5) U6.Y19(VCCIO5)
VREF-IOB: U6.P20(IO,_VREFB5N0) U6.R17(IO,_VREFB5N1)
VSS: U6.AA21(IO,_DIFFIO_R35p,_(DM3R/BWS#3R)/(DM3R/BWS#3R)/(DM1R/BWS#1R)) U6.G22(CLK5,_DIFFCLK_2n) U6.P17(IO) U6.R20(IO,_(DQ3R)/(DQ3R)/(DQ1R)) U6.T18(IO,_RDN3)
AC97-CLK: U6.H19(IO,_DIFFIO_R10p,_(DQ0R)/(DQ1R)/(DQ1R))
AC97-FS: U6.J15(IO)
AC97-RX: U6.J16(IO,_DIFFIO_R14n)
AC97-TX: U6.H16(IO,_DIFFIO_R8p)
IOB0-DIFFn0: U6.M15(IO,_DIFFIO_R29n)
IOB1-DIFFp0: U6.N15(IO,_DIFFIO_R29p)
IOB2-DIFFn1: U6.N17(IO,_DIFFIO_R22n)
IOB3-DIFFp1: U6.N18(IO,_DIFFIO_R22p,_(DQS1R/CQ1R#,DPCLK6)/(DQS1R/CQ1R#,DPCLK6)/(DQS1R/CQ1R#,DPCLK6))
IOB4-DIFFn2: U6.N20(IO,_DIFFIO_R23n,_(DQ1R)/(DQ3R)/(DQ1R))
IOB5-DIFFp2: U6.N19(IO,_DIFFIO_R23p)
IOB6-DIFFn3: U6.W20(IO,_DIFFIO_R34n,_(DQS3R/CQ3R#,CDPCLK4)/(DQS3R/CQ3R#,CDPCLK4)/(DQS3R/CQ3R#,CDPCLK4))
IOB7-DIFFp3: U6.W19(IO,_DIFFIO_R34p)
IOB8-DIFFn4: U6.Y22(IO,_DIFFIO_R33n,_(DQ3R)/(DQ3R)/(DQ1R))
IOB9-DIFFp4: U6.Y21(IO,_DIFFIO_R33p)
IOB10-DIFFn5: U6.W22(IO,_DIFFIO_R31n,_(DQ3R)/(DQ3R)/(DQ1R))
IOB11-DIFFp5: U6.W21(IO,_DIFFIO_R31p,_(DQ3R)/(DQ3R)/(DQ1R))
IOB12-DIFFn6: U6.V22(IO,_DIFFIO_R28n,_(DQ3R)/(DQ3R)/(DQ1R))
IOB13-DIFFp6: U6.V21(IO,_DIFFIO_R28p,_(DQ3R)/(DQ3R)/(DQ1R))
IOB14-DIFFn7: U6.U22(IO,_DIFFIO_R27n,_(DQ3R)/(DQ3R)/(DQ1R))
IOB15-DIFFp7: U6.U21(IO,_DIFFIO_R27p,_(DQ3R)/(DQ3R)/(DQ1R))
IOB16-DIFFn8: U6.P15(IO,_DIFFIO_R30n)
IOB17-DIFFp8: U6.P16(IO,_DIFFIO_R30p)
IOB18-DIFFn9: U6.U20(IO,_DIFFIO_R32n,_(DQ3R)/(DQ3R)/(DQ1R))
IOB19-DIFFp9: U6.U19(IO,_DIFFIO_R32p)
IOB20-DIFFn10: U6.R18(IO,_DIFFIO_R26n)
IOB21-DIFFp10: U6.R19(IO,_DIFFIO_R26p,_(DM1R/BWS#1R)/(DM3R/BWS#3R)/(DM1R/BWS#1R))
IOB22-DIFFn11: U6.M20(IO,_DIFFIO_R19n,_(DQ1R)/(DQ3R)/(DQ1R))
IOB23-DIFFp11: U6.M19(IO,_DIFFIO_R19p,_(DQ1R)/(DQ3R)/(DQ1R))
IOB24-DIFFn12: U6.R22(IO,_DIFFIO_R25n,_(DQ1R)/(DQ3R)/(DQ1R))
IOB25-DIFFp12: U6.R21(IO,_DIFFIO_R25p,_(DQ1R)/(DQ3R)/(DQ1R))
IOB26-DIFFn13: U6.P22(IO,_DIFFIO_R24n,_(DQ1R)/(DQ3R)/(DQ1R))
IOB27-DIFFp13: U6.P21(IO,_DIFFIO_R24p,_(DQ1R)/(DQ3R)/(DQ1R))
IOB28-DIFFn14: U6.N22(IO,_DIFFIO_R21n,_(DEV_OE))
IOB29-DIFFp14: U6.N21(IO,_DIFFIO_R21p,_(DEV_CLRn))
IOB30-DIFFn15: U6.M22(IO,_DIFFIO_R20n,_(DQ1R)/(DQ3R)/(DQ1R))
IOB31-DIFFp15: U6.M21(IO,_DIFFIO_R20p,_(DQ1R)/(DQ3R)/(DQ1R))
IOB-CLKIN0p: U6.T21(CLK6,_DIFFCLK_3p)
IOB-CLKIN1n: U6.T22(CLK7,_DIFFCLK_3n)
IOB-CLKOUT0p: U6.P14(IO)
IOB-CLKOUT1n: U6.N14(IO)
ISI-DATA0: U6.L15(IO,_DIFFIO_R18p)
ISI-DATA1: U6.K22(IO,_DIFFIO_R16n,_(nCEO))
ISI-DATA2: U6.K16(IO,_DIFFIO_R14p)
ISI-DATA3: U6.L21(IO,_DIFFIO_R17p,_(CRC_ERROR))
ISI-DATA4: U6.L16(IO,_DIFFIO_R18n)
ISI-DATA5: U6.J18(IO)
ISI-DATA6: U6.C20(IO,_DIFFIO_R2n,_(PADD20),_(DQS2R/CQ3R,CDPCLK5)/(DQS2R/CQ3R,CDPCLK5)/(DQS2R/CQ3R,CDPCLK5))
ISI-DATA7: U6.H20(IO,_DIFFIO_R10n,_(DQ0R)/(DQ1R)/(DQ1R))
ISI-DATA8: U6.K15(IO)
ISI-DATA9: U6.J17(IO,_DIFFIO_R8n)
ISI-DATA10: U6.G18(IO,_DIFFIO_R5n,_(PADD23),_(DQ2R)/(DQ1R)/(DQ1R))
ISI-DATA11: U6.K17(IO,_DIFFIO_R12n)
ISI-HSYNC: U6.H17(IO,_DIFFIO_R5p)
ISI-MCLK: U6.G21(CLK4,_DIFFCLK_2p)
ISI-PCLK: U6.K18(IO,_DIFFIO_R12p,_(DQ0R)/(DQ1R)/(DQ1R))
ISI-VSYNC: U6.G17(IO,_DIFFIO_R1p)
LED-F0B: RN9.3 U6.H21(IO,_DIFFIO_R13p,_(DQ0R)/(DQ1R)/(DQ1R))
LED-F0G: RN9.5 U6.F22(IO,_DIFFIO_R11n,_(DQ0R)/(DQ1R)/(DQ1R))
LED-F0R: RN9.7 U6.F21(IO,_DIFFIO_R11p,_(DQ0R)/(DQ1R)/(DQ1R))
LED-F1B: RN9.1 U6.H22(IO,_DIFFIO_R13n,_(DQ0R)/(DQ1R)/(DQ1R))
LED-F1G: RN10.3 U6.E21(IO,_DIFFIO_R9p,_(nOE),_(_)/(DQ1R)/(DQ1R))
LED-F1R: RN10.5 U6.D22(IO,_DIFFIO_R7n,_(DM2R)/(DM1R/BWS#1R)/(DM1R/BWS#1R))
LED-F2B: RN10.7 U6.D21(IO,_DIFFIO_R7p,_(_)/(DQ1R)/(DQ1R))
LED-F2G: RN11.7 U6.B21(IO,_DIFFIO_R3p,_(PADD21),_(DQ2R)/(DQ1R)/(DQ1R))
LED-F2R: RN11.5 U6.B22(IO,_DIFFIO_R3n,_(PADD22),_(DQ2R)/(DQ1R)/(DQ1R))
LED-F3B: RN10.1 U6.E22(IO,_DIFFIO_R9n,_(nWE),_(DQ0R)/(DQ1R)/(DQ1R))
LED-F3G: RN11.3 U6.C21(IO,_DIFFIO_R4p,_(DQ2R)/(DQ1R)/(DQ1R))
LED-F3R: RN11.1 U6.C22(IO,_DIFFIO_R4n,_(DQ2R)/(DQ1R)/(DQ1R))
M1-EINT1: U6.K21(IO,_DIFFIO_R16p,_(CLKUSR))
M1-EINT7: U6.J21(IO,_DIFFIO_R15p,_(DM0R)/(DM1R/BWS#1R)/(DM1R/BWS#1R))
M1-RSTn: U6.J22(IO,_DIFFIO_R15n,_(DQS0R/CQ1R,DPCLK7)/(DQS0R/CQ1R,DPCLK7)/(DQS0R/CQ1R,DPCLK7))
PD20-TIOA0: U6.F17(IO,_DIFFIO_R1n,_(DQ2R)/(DQ1R)/(DQ1R))
PD21-TIOA1: U6.F20(IO,_DIFFIO_R6n,_(nAVD),_(DQ2R)/(DQ1R)/(DQ1R))
PD22-TIOA2: U6.D20(IO,_DIFFIO_R2p)
PD23-TCLK0: U6.F19(IO,_DIFFIO_R6p,_(DQ2R)/(DQ1R)/(DQ1R))
xLED-F0B: LD5.1(BN) RN9.4
xLED-F0G: LD5.2(GN) RN9.6
xLED-F0R: LD5.3(RN) RN9.8
xLED-F1B: LD6.1(BN) RN9.2
xLED-F1G: LD6.2(GN) RN10.4
xLED-F1R: LD6.3(RN) RN10.6
xLED-F2B: LD7.1(BN) RN10.8
xLED-F2G: LD7.2(GN) RN11.8
xLED-F2R: LD7.3(RN) RN11.6
xLED-F3B: LD8.1(BN) RN10.2
xLED-F3G: LD8.2(GN) RN11.4
xLED-F3R: LD8.3(RN) RN11.2
NetLD9_1: LD9.1 U6.L22(IO,_DIFFIO_R17n,_(INIT_DONE))
NetLD9_2: LD9.2 R30.1

Not connected (* = marked no-connect by the designer): U6 H18(IO,_VREFB6N0)* K19(IO,_VREFB6N1)* M16(IO)* N16(IO)* T17(IO,_RUP3)*

### Notes on the sheet
- Title:
- Project:
- Sheet:
- Of
- Size:
- D/N:
- Rev:
- Date:
- P/N:
- S/N:
- Designer:
- C
- (in symbol EP4CE15F23, part C) BANK 5; BANK 6

### Library data of the parts
LD5-LD8 = LED_3B: LED Pack 3; PartNumber: LL-S197BRGBC; Value: RGB; Vendor: Luckylight; Designer: shyul; SerialNumber: 0; PinCountSMD: 4; Status: S0; Version: 1.0; VersionDate: 04-27-2011; Publisher: Cowin; PCBMarker: LED; PinCountHole: 0
LD9 = LED: as LD1 on sheet 04_ARM_B; Status: S0; Version: 1.0; Publisher: Cowin; SerialNumber: 0; VersionDate: 04-27-2011; PCBMarker: LED; PinCountHole: 0
R30 = RES: as R1 on sheet 02_XEM; SerialNumber: 0; Value: 330 R; Version: 1.0; VersionDate: 04-27-2011; PCBMarker: Resistor; Publisher: Cowin; PinCountHole: 0
RN9-RN11 = RES_N4: as RN8 on sheet 04_ARM_B; Value: 390 R; Version: 1.0; VersionDate: 04-27-2011; Publisher: Cowin; PCBMarker: Resistor Array; PinCountHole: 0
U6 = EP4CE15F23: as U6 on sheet 05_FPGA_A; PCBMarker: FPGA; Version: 1.0; VersionDate: 2-17-2012; Value: EP4CE15F23; Publisher: Cowin